# EAGLE design Main_PCB (EAGLE 9.6.1)

## Sheet 1 of 2
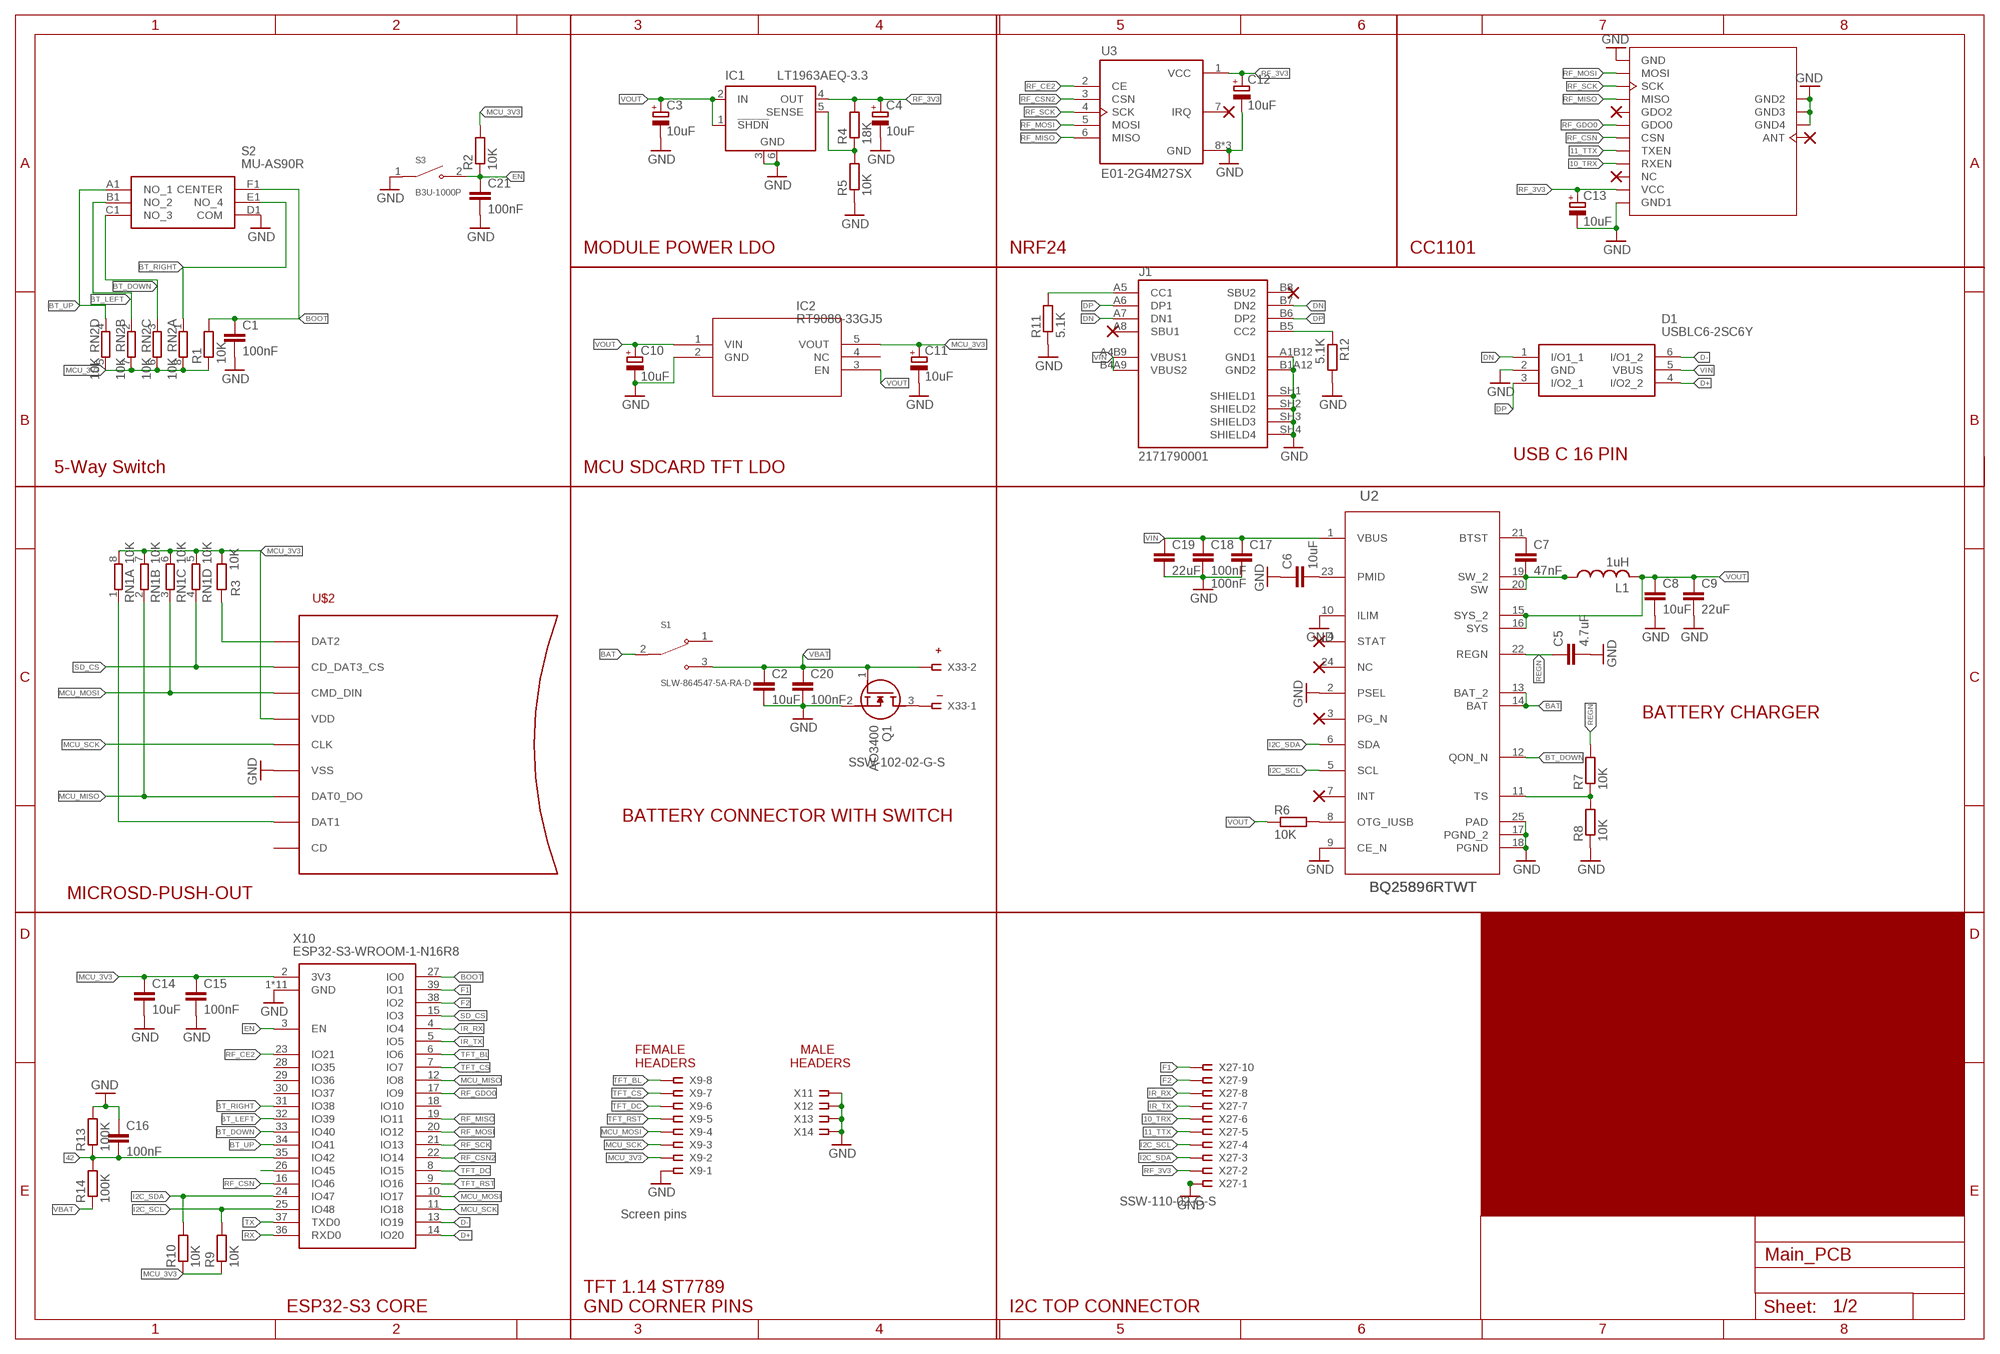
[diagram p0: schematic, sheet 1]

### Parts
C1  100nF  C-EUC0603  [C0603]
C2  10uF  C-EUC0603  [C0603]
C3  10uF  CPOL-EUCT3216  [CT3216]
C4  10uF  CPOL-EUCT3216  [CT3216]
C5  4.7uF  C-EUC0603  [C0603]
C6  10uF  C-EUC0603  [C0603]
C7  47nF  C-EUC0603  [C0603]
C8  10uF  C-EUC0603  [C0603]
C9  22uF  C-EUC0603  [C0603]
C10  10uF  CPOL-EUCT3216  [CT3216]
C11  10uF  CPOL-EUCT3216  [CT3216]
C12  10uF  CPOL-EUCT3216  [CT3216]
C13  10uF  CPOL-EUCT3216  [CT3216]
C14  10uF  C-EUC1206  [C1206]
C15  100nF  C-EUC1206  [C1206]
C16  100nF  C-EUC0603  [C0603]
C17  100nF  C-EUC0603  [C0603]
C18  100nF  C-EUC0603  [C0603]
C19  22uF  C-EUC0603  [C0603]
C20  100nF  C-EUC0603  [C0603]
C21  100nF  C-EUC0603  [C0603]
D1  USBLC6-2SC6Y  [SOT95P280X145-6N]
IC1  LT1963AEQ-3.3  [Q5-DD]
IC2  RT9080-33GJ5  [TSOT-23-5_RIT]
J1  2171790001  [MOLEX_2171790001]
L1  1uH  L-USL4035M  [L4035M]
Q1  AO3400  [SOT95P280X125-3N]
R1  10K  R-EU_R0603  [R0603]
R2  10K  R-EU_R0603  [R0603]
R3  10K  R-EU_R0603  [R0603]
R4  18K  R-EU_R0603  [R0603]
R5  10K  R-EU_R0603  [R0603]
R6  10K  R-EU_R0603  [R0603]
R7  10K  R-EU_R0603  [R0603]
R8  10K  R-EU_R0603  [R0603]
R9  10K  R-EU_R0603  [R0603]
R10  10K  R-EU_R0603  [R0603]
R11  5.1K  R-EU_R0603  [R0603]
R12  5.1K  R-EU_R0603  [R0603]
R13  100K  R-EU_R0603  [R0603]
R14  100K  R-EU_R0603  [R0603]
RN1  10K  4R-N0603-ARV  [0603-ARV]
RN2  10K  4R-N0603-ARV  [0603-ARV]
S1  SLW-864547-5A-RA-D  [SW_SLW-864547-5A-RA-D]
S2  MU-AS90R  [MUAS90R]
S3  B3U-1000P  [SW_B3U-1000P]
U2  BQ25896RTWT  [RTW0024H]
U3  E01-2G4M27SX  [XCVR_E01-2G4M27SX]
U4  PE07-433M20S  [PE07-433M20S]
U$2  MICROSD-PUSH-OUT  [MICROSD-PUSH-OUT]
X9  Screen pins  SSW-108-02-G-S  [SSW-108-02-G-S]
X10  ESP32-S3-WROOM-1-N16R8  [ESP32S3WROOM1N8R2]
X11  SSW-101-02-G-S  [SSW-101-02-G-S]
X12  SSW-101-02-G-S  [SSW-101-02-G-S]
X13  SSW-101-02-G-S  [SSW-101-02-G-S]
X14  SSW-101-02-G-S  [SSW-101-02-G-S]
X27  SSW-110-02-G-S  [SSW-110-02-G-S]
X33  SSW-102-02-G-S  [SSW-102-02-G-S]

### Nets
10_TRX: U4.RXEN X27.6
11_TTX: U4.TXEN X27.5
42: C16.2 R13.1 R14.2 X10.35(IO42)
BAT: S1.2 U2.13(BAT_2) U2.14(BAT)
BOOT: C1.1 R1.2 S2.F1(CENTER) X10.27(IO0)
BT_DOWN: RN2.3 S2.C1(NO_3) U2.12(QON_N) X10.33(IO40)
BT_LEFT: RN2.2 S2.B1(NO_2) X10.32(IO39)
BT_RIGHT: RN2.1 S2.E1(NO_4) X10.31(IO38)
BT_UP: RN2.4 S2.A1(NO_1) X10.34(IO41)
D+: D1.4(I/O2_2) X10.14(IO20)
D-: D1.6(I/O1_2) X10.13(IO19)
DN: D1.1(I/O1_1) J1.A7(DN1) J1.B7(DN2)
DP: D1.3(I/O2_1) J1.A6(DP1) J1.B6(DP2)
EN: C21.1 R2.1 S3.2 X10.3(EN)
F1: X10.39(IO1) X27.10
F2: X10.38(IO2) X27.9
GND: C1.2 C2.2 C3.- C4.- C5.2 C6.1 C8.2 C9.2 C10.- C11.- C12.- C13.- C14.2 C15.2 C16.1 C17.2 C18.2 C19.2 C20.2 C21.2 D1.2(GND) IC1.3(GND) IC1.6(GND) IC2.2(GND) J1.A1B12(GND1) J1.B1A12(GND2) J1.SH1(SHIELD1) J1.SH2(SHIELD2) J1.SH3(SHIELD3) J1.SH4(SHIELD4) Q1.2(S) R5.1 R8.1 R11.1 R12.2 R13.2 S2.D1(COM) S3.1 U2.2(PSEL) U2.9(CE_N) U2.10(ILIM) U2.17(PGND_2) U2.18(PGND) U2.25(PAD) U3.8(GND) U3.9(GND) U3.10(GND) U4.GND U4.GND1 U4.GND2 U4.GND3 U4.GND4 U$2.6(VSS) U$2.G1(VSS) U$2.G2(VSS) U$2.G3(VSS) U$2.G4(VSS) X9.1 X10.1(GND) X10.40(GND) X10.41(GND) X10.42(GND) X10.43(GND) X10.44(GND) X10.45(GND) X10.46(GND) X10.47(GND) X10.48(GND) X10.49(GND) X11.1 X12.1 X13.1 X14.1 X27.1 ; also sheet 2
I2C_SCL: R9.2 U2.5(SCL) X10.25(IO48) X27.4
I2C_SDA: R10.2 U2.6(SDA) X10.24(IO47) X27.3
IR_RX: X10.4(IO4) X27.8
IR_TX: X10.5(IO5) X27.7
MCU_3V3: C11.+ C14.1 C15.1 IC2.5(VOUT) R1.1 R2.2 R3.2 R9.1 R10.1 RN1.5 RN1.6 RN1.7 RN1.8 RN2.5 RN2.6 RN2.7 RN2.8 U$2.4(VDD) X9.2 X10.2(3V3)
MCU_MISO: RN1.2 U$2.7(DAT0_DO) X10.12(IO8)
MCU_MOSI: RN1.3 U$2.3(CMD_DIN) X9.4 X10.10(IO17)
MCU_SCK: U$2.5(CLK) X9.3 X10.11(IO18)
N$1: J1.A5(CC1) R11.2
N$2: J1.B5(CC2) R12.1
N$4: X10.26(IO45)
N$8: R3.1 U$2.1(DAT2)
N$13: Q1.3(D) X33.1
N$16: RN1.1 U$2.8(DAT1)
N$18: IC1.5(SENSE) R4.1 R5.2
N$20: C7.1 U2.21(BTST)
N$22: C7.2 L1.1 U2.19(SW_2) U2.20(SW)
N$23: R6.2 U2.8(OTG_IUSB)
N$24: R7.1 R8.2 U2.11(TS)
N$29: C6.2 U2.23(PMID)
REGN: C5.1 R7.2 U2.22(REGN)
RF_3V3: C4.+ C12.+ C13.+ IC1.4(OUT) R4.2 U3.1(VCC) U4.VCC X27.2
RF_CE2: U3.2(CE) X10.23(IO21)
RF_CSN: U4.CSN X10.16(IO46)
RF_CSN2: U3.3(CSN) X10.22(IO14)
RF_GDO0: U4.GDO0 X10.17(IO9)
RF_MISO: U3.6(MISO) U4.MISO X10.19(IO11)
RF_MOSI: U3.5(MOSI) U4.MOSI X10.20(IO12)
RF_SCK: U3.4(SCK) U4.SCK X10.21(IO13)
RX: X10.36(RXD0)
SD_CS: RN1.4 U$2.2(CD_DAT3_CS) X10.15(IO3)
TFT_BL: X9.8 X10.6(IO6)
TFT_CS: X9.7 X10.7(IO7)
TFT_DC: X9.6 X10.8(IO15)
TFT_RST: X9.5 X10.9(IO16)
TX: X10.37(TXD0)
VBAT: C2.1 C20.1 Q1.1(G) R14.1 S1.3 X33.2
VIN: C17.1 C18.1 C19.1 D1.5(VBUS) J1.A4B9(VBUS1) J1.B4A9(VBUS2) U2.1(VBUS)
VOUT: C3.+ C8.1 C9.1 C10.+ IC1.1(!SHDN) IC1.2(IN) IC2.1(VIN) IC2.3(EN) L1.2 R6.1 U2.15(SYS_2) U2.16(SYS)
Unconnected: IC2.4(NC) J1.A8(SBU1) J1.B8(SBU2) S1.1 U2.3(PG_N) U2.4(STAT) U2.7(INT) U2.24(NC) U3.7(IRQ) U4.ANT U4.GDO2 U4.NC U$2.CD X10.18(IO10) X10.28(IO35) X10.29(IO36) X10.30(IO37)

### Notes on the sheet
- MODULE POWER LDO | NRF24 | CC1101
- USB C 16 PIN
- 5-Way Switch | MCU SDCARD TFT LDO
- BATTERY CHARGER
- BATTERY CONNECTOR WITH SWITCH
- FEMALE 
  HEADERS
- MALE 
  HEADERS
- ESP32-S3 CORE
- TFT 1.14 ST7789
  GND CORNER PINS
- I2C TOP CONNECTOR

## Sheet 2 of 2
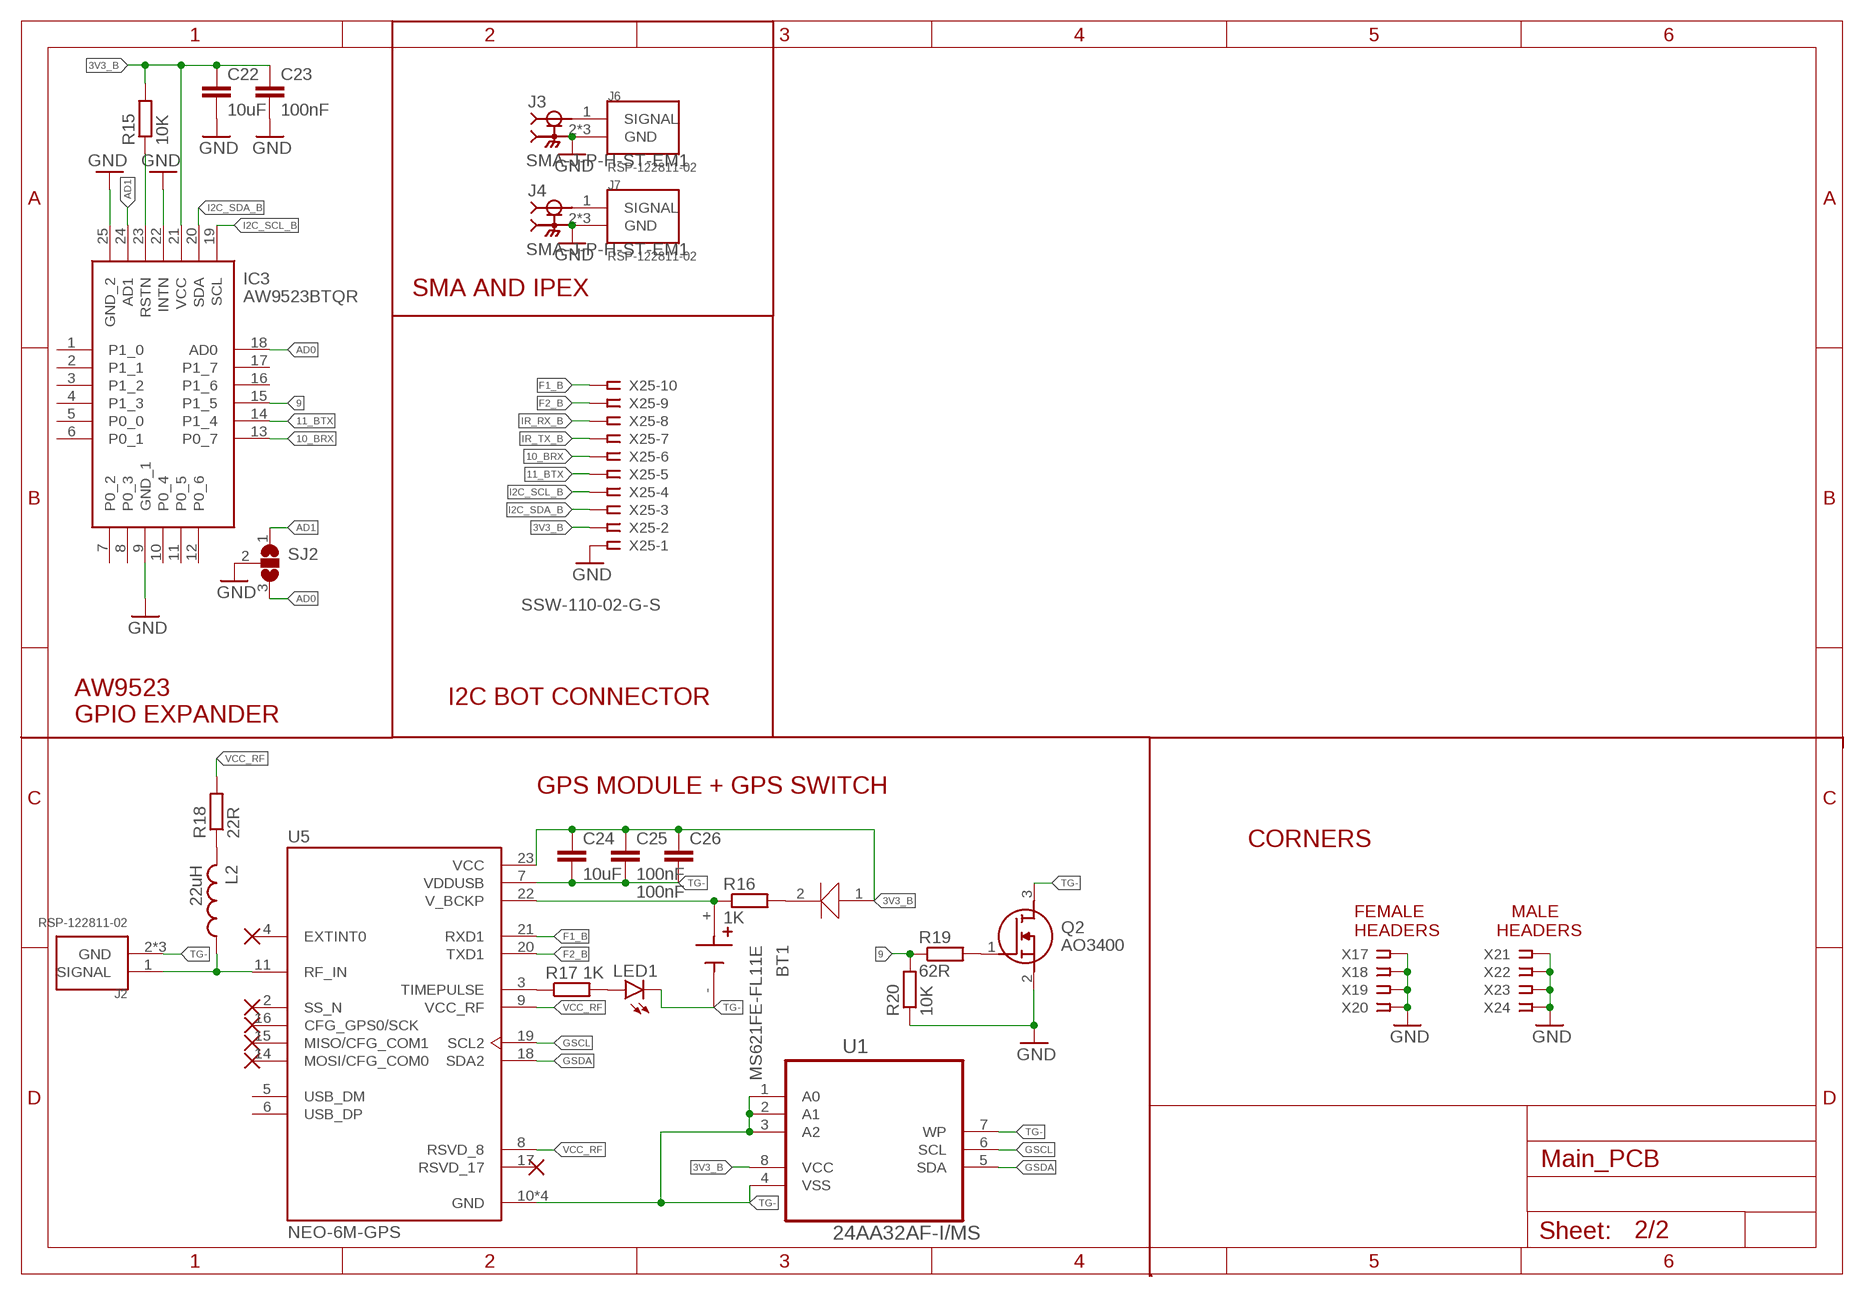
[diagram p1: schematic, sheet 2]

### Parts
BT1  MS621FE-FL11E  [BAT_MS621FE-FL11E]
C22  10uF  C-EUC0603  [C0603]
C23  100nF  C-EUC0603  [C0603]
C24  10uF  C-EUC0603  [C0603]
C25  100nF  C-EUC0603  [C0603]
C26  100nF  C-EUC0603  [C0603]
IC3  AW9523BTQR  [QFN50P400X400X80-25N]
J2  RSP-122811-02  [SAMTEC_RSP-122811-02]
J3  SMA-J-P-H-ST-EM1  [SAMTEC_SMA-J-P-H-ST-EM1]
J4  SMA-J-P-H-ST-EM1  [SAMTEC_SMA-J-P-H-ST-EM1]
J6  RSP-122811-02  [SAMTEC_RSP-122811-02]
J7  RSP-122811-02  [SAMTEC_RSP-122811-02]
L2  22uH  L-USL3225P  [L3225P]
LED1  LEDCHIP-LED0805  [CHIP-LED0805]
Q2  AO3400  [SOT95P280X125-3N]
R15  10K  R-EU_R0603  [R0603]
R16  1K  R-EU_R0603  [R0603]
R17  1K  R-EU_R0603  [R0603]
R18  22R  R-EU_R0603  [R0603]
R19  62R  R-EU_R0603  [R0603]
R20  10K  R-EU_R0603  [R0603]
SJ2  SJ2W  [SJ_2]
U1  24AA32AF-I/MS  [SOP65P490X110-8N]
U5  NEO-6M-GPS  [XCVR_NEO-6M-GPS]
U$1  5817SMJ_TR13  [DIOM5336X250N]
X17  SSW-101-02-G-S  [SSW-101-02-G-S]
X18  SSW-101-02-G-S  [SSW-101-02-G-S]
X19  SSW-101-02-G-S  [SSW-101-02-G-S]
X20  SSW-101-02-G-S  [SSW-101-02-G-S]
X21  SSW-101-02-G-S  [SSW-101-02-G-S]
X22  SSW-101-02-G-S  [SSW-101-02-G-S]
X23  SSW-101-02-G-S  [SSW-101-02-G-S]
X24  SSW-101-02-G-S  [SSW-101-02-G-S]
X25  SSW-110-02-G-S  [SSW-110-02-G-S]

### Nets
3V3_B: C22.1 C23.1 C24.1 C25.1 C26.1 IC3.21(VCC) R15.2 U1.8(VCC) U5.23(VCC) U$1.1 X25.2
9: IC3.15(P1_5) R19.1 R20.2
10_BRX: IC3.13(P0_7) X25.6
11_BTX: IC3.14(P1_4) X25.5
AD0: IC3.18(AD0) SJ2.3
AD1: IC3.24(AD1) SJ2.1
F1_B: U5.21(RXD1) X25.10
F2_B: U5.20(TXD1) X25.9
GND: C22.2 C23.2 IC3.9(GND_1) IC3.22(INTN) IC3.25(GND_2) J3.2_1 J3.2_2 J3.3_1 J3.3_2 J4.2_1 J4.2_2 J4.3_1 J4.3_2 J6.2(GND) J6.3(GND) J6.4(GND) J7.2(GND) J7.3(GND) J7.4(GND) Q2.2(S) R20.1 SJ2.2 X17.1 X18.1 X19.1 X20.1 X21.1 X22.1 X23.1 X24.1 X25.1 ; also sheet 1
GSCL: U1.6(SCL) U5.19(SCL2)
GSDA: U1.5(SDA) U5.18(SDA2)
I2C_SCL_B: IC3.19(SCL) X25.4
I2C_SDA_B: IC3.20(SDA) X25.3
IR_RX_B: X25.8
IR_TX_B: X25.7
N$3: BT1.+ R16.1 U5.22(V_BCKP)
N$5: R17.1 U5.3(TIMEPULSE)
N$6: LED1.A R17.2
N$7: R16.2 U$1.2
N$9: J2.1(SIGNAL) L2.1 U5.11(RF_IN)
N$10: IC3.23(RSTN) R15.1
N$11: L2.2 R18.1
N$12: Q2.1(G) R19.2
N$15: J3.1 J6.1(SIGNAL)
N$19: J4.1 J7.1(SIGNAL)
TG-: BT1.- C24.2 C25.2 C26.2 J2.2(GND) J2.3(GND) J2.4(GND) LED1.C Q2.3(D) U1.1(A0) U1.2(A1) U1.3(A2) U1.4(VSS) U1.7(WP) U5.7(VDDUSB) U5.10(GND) U5.12(GND) U5.13(GND) U5.24(GND)
VCC_RF: R18.2 U5.8(RSVD_8) U5.9(VCC_RF)
Unconnected: IC3.1(P1_0) IC3.2(P1_1) IC3.3(P1_2) IC3.4(P1_3) IC3.5(P0_0) IC3.6(P0_1) IC3.7(P0_2) IC3.8(P0_3) IC3.10(P0_4) IC3.11(P0_5) IC3.12(P0_6) IC3.16(P1_6) IC3.17(P1_7) U5.2(SS_N) U5.4(EXTINT0) U5.5(USB_DM) U5.6(USB_DP) U5.14(MOSI/CFG_COM0) U5.15(MISO/CFG_COM1) U5.16(CFG_GPS0/SCK) U5.17(RSVD_17)

### Notes on the sheet
- SMA AND IPEX
- I2C BOT CONNECTOR
- AW9523
  GPIO EXPANDER
- GPS MODULE + GPS SWITCH
- CORNERS
- FEMALE
  HEADERS
- MALE
  HEADERS

## Library data of the parts
BT1 = MS621FE-FL11E:MS621FE-FL11E: Check availability <https://pricing.snapeda.com/parts/MS621FE-FL11E/Seiko%20Instruments/view-part?ref=eda>; AVAILABILITY: In Stock; CHECK_PRICES: https://www.snapeda.com/parts/MS621FE-FL11E/Seiko/view-part/?ref=eda; DESCRIPTION: Coin, 6.8mm 3 V Lithium Battery Rechargeable (Secondary) 5.5mAh; MF: Seiko Instruments; MP: MS621FE-FL11E; PACKAGE: QFP-128 Seiko; PRICE: None; SNAPEDA_LINK: https://www.snapeda.com/parts/MS621FE-FL11E/Seiko/view-part/?ref=snap
C1 C2 C5-C9 C14-C26 = rcl:C-EU: CAPACITOR, European symbol; SPICEPREFIX: C
C3 C4 C10-C13 = rcl:CPOL-EU: POLARIZED CAPACITOR, European symbol; SPICEPREFIX: C
D1 = USBLC6-2SC6Y:USBLC6-2SC6Y: Check availability <https://pricing.snapeda.com/parts/USBLC6-2SC6Y/STMicroelectronics/view-part?ref=eda>; AVAILABILITY: In Stock; CHECK_PRICES: https://www.snapeda.com/parts/USBLC6-2SC6Y/STMicroelectronics/view-part/?ref=eda; DESCRIPTION: 17V Clamp 5A (8/20µs) Ipp Tvs Diode Surface Mount SOT-23-6; MF: STMicroelectronics; MP: USBLC6-2SC6Y; PACKAGE: SOT-23-6 STMicroelectronics; PRICE: None; SNAPEDA_LINK: https://www.snapeda.com/parts/USBLC6-2SC6Y/STMicroelectronics/view-part/?ref=snap
IC1 = linear-technology:LT1963AEQ*: LT1963 1.5A, Low Noise, Fast Transient Response LDO Regulator Source: http://www.linear.com; MPN: LT1963AEQ-3.3; OC_FARNELL: 1273626; OC_NEWARK: 57M7439
IC2 = RT9080-33GJ5:RT9080-33GJ5; COPYRIGHT: Copyright (C) 2025 Ultra Librarian. All rights reserved.; MANUFACTURER_PART_NUMBER: RT9080-33GJ5; MFR_NAME: Richtek Technology
IC3 = AW9523BTQR:AW9523BTQR: 16 MULTI-FUNCTION LED DRIVER AND GPIO CONTROLLER WITH I2C INTERFACE Source: Datasheet <https://www.alldatasheet.net/datasheet-pdf/pdf/1148543/AWINIC/AW9523BTQR.html>; DESCRIPTION: 16 MULTI-FUNCTION LED DRIVER AND GPIO CONTROLLER WITH I2C INTERFACE; HEIGHT: 0.8mm; MANUFACTURER_NAME: AWINIC; MANUFACTURER_PART_NUMBER: AW9523BTQR
J1 = type_C:2171790001: Check availability <https://pricing.snapeda.com/parts/217179-0001/Molex/view-part?ref=eda>; AVAILABILITY: In Stock; CHECK_PRICES: https://www.snapeda.com/parts/217179-0001/Molex/view-part/?ref=eda; DESCRIPTION: USB Type C - Connector, Top-mount SMT, 16pos | Molex Incorporated 217179-0001; MF: Molex; MP: 217179-0001; PACKAGE: None; PRICE: None; SNAPEDA_LINK: https://www.snapeda.com/parts/217179-0001/Molex/view-part/?ref=snap
J2 J6 J7 = IPEX_conn_male:RSP-122811-02: Check availability <https://pricing.snapeda.com/parts/RSP-122811-02/Samtec%20Inc./view-part?ref=eda>; AVAILABILITY: In Stock; CHECK_PRICES: https://www.snapeda.com/parts/RSP-122811-02/Samtec+Inc./view-part/?ref=eda; DESCRIPTION: I-PEX MHFIII Connector Receptacle, Male Pin 50 Ohms Surface Mount Solder; MF: Samtec Inc.; MP: RSP-122811-02; PACKAGE: None; PRICE: None; SNAPEDA_LINK: https://www.snapeda.com/parts/RSP-122811-02/Samtec+Inc./view-part/?ref=snap
J3 J4 = SMA-J-P-H-ST-EM1:SMA-J-P-H-ST-EM1: Check availability <https://pricing.snapeda.com/parts/SMA-J-P-H-ST-EM1/Samtec/view-part?ref=eda>; AVAILABILITY: In Stock; CHECK_PRICES: https://www.snapeda.com/parts/SMA-J-P-H-ST-EM1/Samtec+Inc./view-part/?ref=eda; DESCRIPTION: SMA Connector Jack, Female Socket 50 Ohms Board Edge, End Launch Solder; MF: Samtec; MP: SMA-J-P-H-ST-EM1; PACKAGE: None; PRICE: None; SNAPEDA_LINK: https://www.snapeda.com/parts/SMA-J-P-H-ST-EM1/Samtec+Inc./view-part/?ref=snap
L1 L2 = rcl:L-US: INDUCTOR, American symbol; SPICEPREFIX: L
LED1 = led:LED: LED OSRAM: - CHIPLED LG R971, LG N971, LY N971, LG Q971, LY Q971, LO R971, LY R971 LH N974, LH R974 LS Q976, LO Q976, LY Q976 LO Q996 - Hyper CHIPLED LW Q18S LB Q993, LB Q99A, LB R99A - SideLED LS A670, LO A670, LY A670, LG A670, LP A670 LB A673, LV A673, LT A673, LW A673 LH A674 LY A675 LS A676, LA A676, LO A676, LY A676, LW A676 LS A679, LY A679, LG A679 - Hyper Micro SIDELED® LS Y876, LA Y876, LO Y876, LY Y876 LT Y87S - SmartLED LW L88C, LW L88S LB L89C, LB L89S, LG L890 LS L89K, LO L89K, LY L89K LS L896, LA L896, LO L896, LY L896 - TOPLED LS T670, LO T670, LY T670, LG T670, LP T670 LSG T670, LSP T670, LSY T670, LOP T670, LYG T670 LG T671, LOG T671, LSG T671 LB T673, LV T673, LT T673, LW T673 LH T674 LS T676, LA T676, LO T676, LY T676, LB T676, LH T676, LSB T676, LW T676 LB T67C, LV T67C, LT T67C, LS T67K, LO T67K, LY T67K, LW E67C LS E67B, LA E67B, LO E67B, LY E67B, LB E67C, LV E67C, LT E67C LW T67C LS T679, LY T679, LG T679 LS T770, LO T770, LY T770, LG T770, LP T770 LB T773, LV T773, LT T773, LW T773 LH T774 LS E675, LA E675, LY E675, LS T675 LS T776, LA T776, LO T776, LY T776, LB T776 LHGB T686 LT T68C, LB T68C - Hyper Mini TOPLED® LB M676 - Mini TOPLED Santana® LG M470 LS M47K, LO M47K, LY M47K Source: http://www.osram.convergy.de LUXEON: - LUMILED® LXK2-PW12-R00, LXK2-PW12-S00, LXK2-PW14-U00, LXK2-PW14-V00 LXK2-PM12-R00, LXK2-PM12-S00, LXK2-PM14-U00 LXK2-PE12-Q00, LXK2-PE12-R00, LXK2-PE12-S00, LXK2-PE14-T00, LXK2-PE14-U00 LXK2-PB12-K00, LXK2-PB12-L00, LXK2-PB12-M00, LXK2-PB14-N00, LXK2-PB14-P00, LXK2-PB14-Q00 LXK2-PR12-L00, LXK2-PR12-M00, LXK2-PR14-Q00, LXK2-PR14-R00 LXK2-PD12-Q00, LXK2-PD12-R00, LXK2-PD12-S00 LXK2-PH12-R00, LXK2-PH12-S00 LXK2-PL12-P00, LXK2-PL12-Q00, LXK2-PL12-R00 Source: www.luxeon.com KINGBRIGHT: KA-3528ASYC Source: www.kingbright.com
Q1 Q2 = AO3400:AO3400: Check availability <https://pricing.snapeda.com/parts/AO3400/Alpha%20%26/view-part?ref=eda>; AVAILABILITY: In Stock; CHECK_PRICES: https://www.snapeda.com/parts/AO3400/Alpha/view-part/?ref=eda; DESCRIPTION: N-Channel 30 V 5.8A (Ta) 1.4W (Ta) Surface Mount SOT-23-3; MF: Alpha &; MP: AO3400; PACKAGE: SOT-23-3 Alpha &amp; Omega Semiconductor; PRICE: None; SNAPEDA_LINK: https://www.snapeda.com/parts/AO3400/Alpha/view-part/?ref=snap
R1-R20 = rcl:R-EU_: RESISTOR, European symbol; SPICEPREFIX: R
RN1 RN2 = resistor-dil:4R-N: Array Chip Resistor Source: RS Component / Phycomp; OC_FARNELL: unknown; OC_NEWARK: unknown
S1 = 90°Switch:SLW-864547-5A-RA-D: Check availability <https://pricing.snapeda.com/parts/SLW-864547-5A-RA-D/Same%20Sky/view-part?ref=eda>; AVAILABILITY: In Stock; CHECK_PRICES: https://www.snapeda.com/parts/SLW-864547-5A-RA-D/Same+Sky/view-part/?ref=eda; DESCRIPTION: 8.6 x 4.5 x 4.7 mm, 5 mm Raised Slide Actuator, Right Angle, Through Hole, Slide Switch; MF: Same Sky; MP: SLW-864547-5A-RA-D; PACKAGE: None; PRICE: None; SNAPEDA_LINK: https://www.snapeda.com/parts/SLW-864547-5A-RA-D/Same+Sky/view-part/?ref=snap
S2 = MU-AS90R:MU-AS90R: Multi-Directional Switches 5-way Switch, SMD, Height 9mm Source: Datasheet <https://www.apem.com/idec-apem/en_US/medias/PCB-MU-serie.pdf?context=bWFzdGVyfGRvY3VtZW50c3w0MTk2OTF8YXBwbGljYXRpb24vcGRmfGg2ZC9oMGEvOTQ2NDU3NTQyNjU5MC9QQ0JfTVVfc2VyaWUucGRmfDhmZDg0OWQ5ZjViYWFlZjljODY5ZmI3YmMzY2U3MzBjNmNiMzE0MzZkY2ZmMjQ4ZGRjNTJjOWQ0ZTc0NG>; DESCRIPTION: Multi-Directional Switches 5-way Switch, SMD, Height 9mm; HEIGHT: 9.2mm; MANUFACTURER_NAME: Apem; MANUFACTURER_PART_NUMBER: MU-AS90R; MOUSER_PART_NUMBER: 642-MU-AS90R; MOUSER_PRICE-STOCK: https://www.mouser.co.uk/ProductDetail/Apem/MU-AS90R?qs=mELouGlnn3cGEpjh4y0%2F8w%3D%3D
S3 = SMD_button:B3U-1000P: Switch Tactile N.O. SPST Round Button Gull Wing 0.05A 12VDC 1.5N SMD Embossed T/R Check availability <https://pricing.snapeda.com/parts/B3U-1000P/Omron/view-part?ref=eda>; AVAILABILITY: In Stock; CHECK_PRICES: https://www.snapeda.com/parts/B3U-1000P/Omron+Electronics+Inc-EMC+Div/view-part/?ref=eda; DESCRIPTION: SWITCH;TACTILE,TOP ACTUATED,TACTILE & JOG SWITCHES W/O BOSS W/O GROUND | Omron Electronic Components B3U-1000P; MF: Omron; MP: B3U-1000P; PACKAGE: Custom Package Omron; PRICE: None; SNAPEDA_LINK: https://www.snapeda.com/parts/B3U-1000P/Omron+Electronics+Inc-EMC+Div/view-part/?ref=snap
SJ2 = jumper:SJ2W: SMD solder JUMPER
U1 = 24AA32AF-I_MS:24AA32AF-I/MS: Check availability <https://pricing.snapeda.com/parts/24AA32AF-I/MS/Microchip/view-part?ref=eda>; AVAILABILITY: In Stock; CHECK_PRICES: https://www.snapeda.com/parts/24AA32AF-I/MS/Microchip/view-part/?ref=eda; DESCRIPTION: 32K, 4K X 8 1.8V SERIAL EE IND, 1/4 ARRAY WRITE PROTECT8 MSOP 3x3mm TUBE | Microchip Technology Inc. 24AA32AF-I/MS; MF: Microchip; MP: 24AA32AF-I/MS; PACKAGE: MSOP-8 Microchip; PRICE: None; SNAPEDA_LINK: https://www.snapeda.com/parts/24AA32AF-I/MS/Microchip/view-part/?ref=snap
U2 = BQ25896RTWT:BQ25896RTWT; COPYRIGHT: Copyright (C) 2025 Ultra Librarian. All rights reserved.; MANUFACTURER_PART_NUMBER: BQ25896RTWT; MFR_NAME: Texas Instruments; REFDES: RefDes; TYPE: TYPE
U3 = E01-2G4M27SX:E01-2G4M27SX: Check availability <https://pricing.snapeda.com/parts/E01-2G4M27SX/EBYTE/view-part?ref=eda>; AVAILABILITY: Not in stock; CHECK_PRICES: https://www.snapeda.com/parts/E01-2G4M27SX/EBYTE/view-part/?ref=eda; DESCRIPTION: nRF42L01+2.4GHz 500mW SPI SMD wireless module; MF: EBYTE; MP: E01-2G4M27SX; PACKAGE: Package; PRICE: None; SNAPEDA_LINK: https://www.snapeda.com/parts/E01-2G4M27SX/EBYTE/view-part/?ref=snap
U4 = E07-CC1101:PE07-433M20S
U5 = NEO-6M-GPS:NEO-6M-GPS: Check availability <https://pricing.snapeda.com/parts/NEO-6M-GPS/u-blox/view-part?ref=eda>; AVAILABILITY: Not in stock; CHECK_PRICES: https://www.snapeda.com/parts/NEO-6M-GPS/u-blox/view-part/?ref=eda; DESCRIPTION: GPS Development Tools SparkFun GNSS-RTK Dead Reckoning Breakout - ZED-F9K (Qwiic); MF: u-blox; MP: NEO-6M-GPS; PACKAGE: None; PRICE: None; SNAPEDA_LINK: https://www.snapeda.com/parts/NEO-6M-GPS/u-blox/view-part/?ref=snap
U$1 = 5817SMJ_TR13:5817SMJ_TR13
U$2 = microsd:MICROSD-PUSH-OUT: T-Flash Push-Out Micro SD Card Reader 14.75mm x 14.5mm SMD with external pins
X9 = con-samtec:SSW-108-02-G-S: THROUGH-HOLE .025" SQ POST SOCKET Source: Samtec SSW.pdf; MF: Samtec Inc.; MPN: SSW-108-02-G-S; OC_FARNELL: unknown; OC_NEWARK: 11P9448
X10 = ESP32-S3-WROOM-1-N16R8:ESP32-S3-WROOM-1-N16R8: Check availability <https://pricing.snapeda.com/parts/ESP32-S3-WROOM-1-N16R8/Espressif%20Systems/view-part?ref=eda>; AVAILABILITY: In Stock; CHECK_PRICES: https://www.snapeda.com/parts/ESP32-S3-WROOM-1-N16R8/Espressif+Systems/view-part/?ref=eda; DESCRIPTION: Bluetooth, WiFi 802.11b/g/n, Bluetooth v5.0 Transceiver Module 2.4GHz PCB Trace Surface Mount; MF: Espressif Systems; MP: ESP32-S3-WROOM-1-N16R8; PACKAGE: NON STANDARD Espressif Systems; PRICE: None; SNAPEDA_LINK: https://www.snapeda.com/parts/ESP32-S3-WROOM-1-N16R8/Espressif+Systems/view-part/?ref=snap
X11-X14 X17-X24 = con-samtec:SSW-101-02-G-S: THROUGH-HOLE .025" SQ POST SOCKET Source: Samtec SSW.pdf; MF: Samtec Inc.; MPN: SSW-101-02-G-S; OC_FARNELL: unknown; OC_NEWARK: 11P9336
X25 X27 = con-samtec:SSW-110-02-G-S: THROUGH-HOLE .025" SQ POST SOCKET Source: Samtec SSW.pdf; MF: Samtec Inc.; MPN: SSW-110-02-G-S; OC_FARNELL: unknown; OC_NEWARK: 11P9482
X33 = con-samtec:SSW-102-02-G-S: THROUGH-HOLE .025" SQ POST SOCKET Source: Samtec SSW.pdf; MF: Samtec Inc.; MPN: SSW-102-02-G-S; OC_FARNELL: unknown; OC_NEWARK: 11P9351

## Board
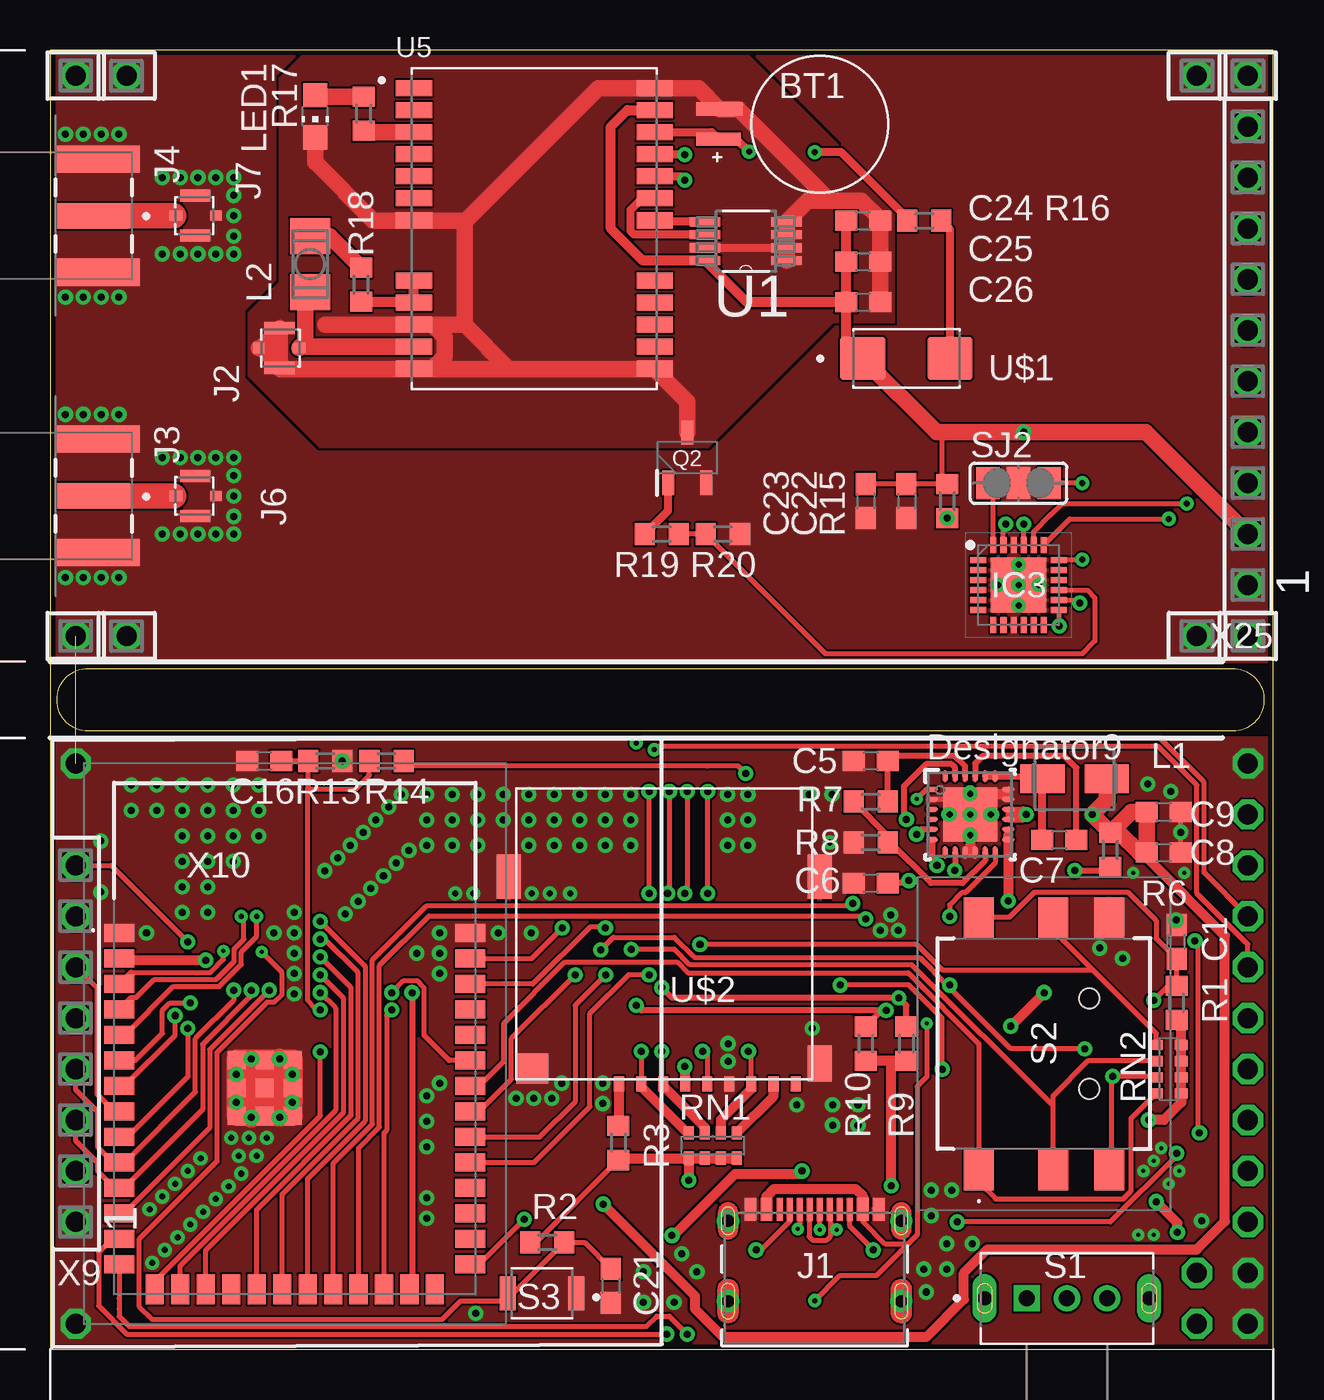
[diagram p2: board, top side]
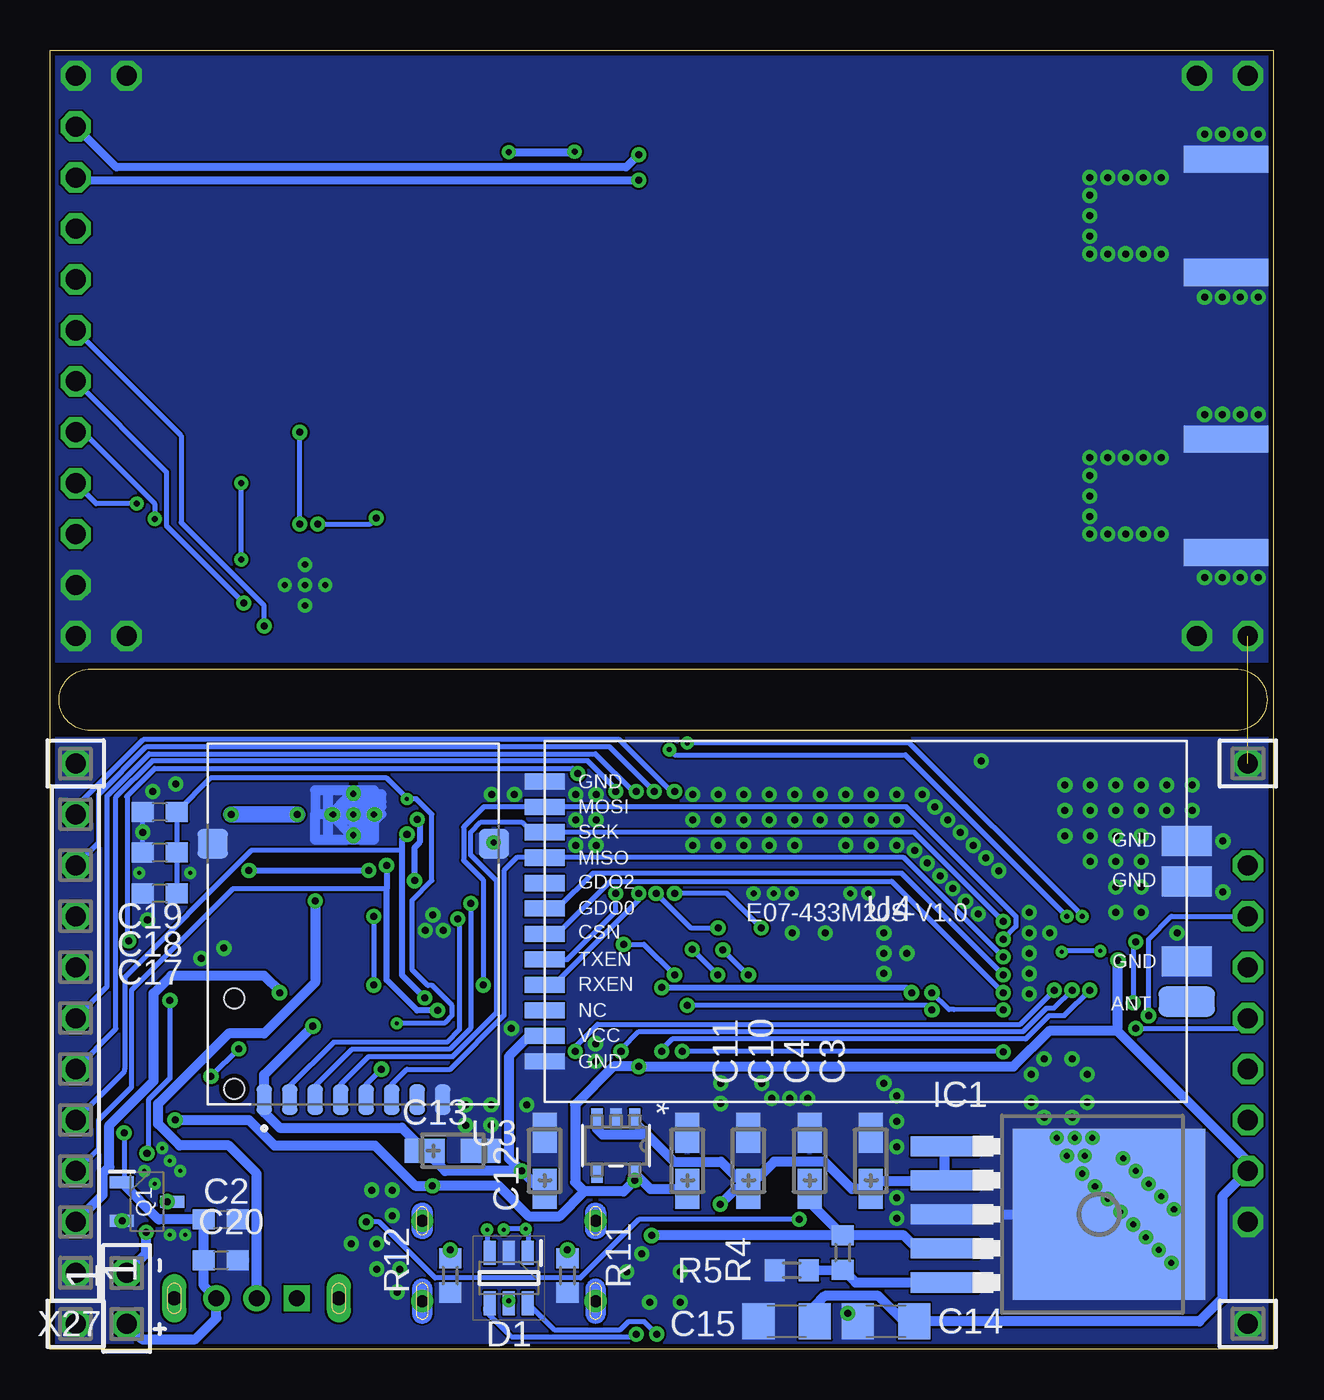
[diagram p3: board, bottom side, seen from below]

Size 60.96 x 64.77 mm. Coordinates in mm from the lower left corner, seen from the top.
Outline: 1.78,30.86 1.91,30.86
Outline: 1.91,30.86 58.93,30.86 arc180 59.05,33.91 1.91,33.91 arc185 1.91,30.86
Outline: 0,0 60.96,0 60.96,64.77 0,64.77 0,0
Copper layers (1*16): Top 0.035mm / dielectric 1.5mm / Bottom 0.035mm
Design rules "default *": minimum track width 4mil, minimum drill 0.1mm, track to track 4mil, track to pad 4mil, pad to pad 4mil, via to via 4mil, smd to smd 4mil, copper to edge 10mil, drill to drill 4mil, minimum pad ring 10mil, minimum via ring 8mil, stop-mask expansion 4mil, vias tented up to drill 0mil, thermal gap 0mil

### Footprints (pad centres in the part's own frame; a part is rotated, then mirrored left to right if it is on the bottom)
BAT_MS621FE-FL11E = smd 2.2 x 0.65: + 5.05,0.75 | smd 2.3 x 0.65: - 5,-0.75
C0603 = smd 1.1 x 1: 1 -0.85,0; 2 0.85,0
CT3216 = smd 2 x 1.2: + -1.4,0; - 1.4,0
C1206 = smd 1.6 x 1.8: 1 -1.4,0; 2 1.4,0
SOT95P280X145-6N = smd 1.2 x 0.6: 1 -1.25,0.95; 2 -1.25,0; 3 -1.25,-0.95; 4 1.25,-0.95; 5 1.25,0; 6 1.25,0.95
Q5-DD = smd 1 x 3.4: 1 -3.4,-7.875; 2 -1.7,-7.875; 3 0,-7.875; 4 1.7,-7.875; 5 3.4,-7.875 | smd 8.5 x 9.6: 6 0,0.325
TSOT-23-5_RIT = smd 0.953 x 0.559: 1 -1.378,0.94; 2 -1.378,0; 3 -1.378,-0.94; 4 1.378,-0.94; 5 1.378,0.94
QFN50P400X400X80-25N = smd 0.8 x 0.3: 1 -2,1.25; 2 -2,0.75; 3 -2,0.25; 4 -2,-0.25; 5 -2,-0.75; 6 -2,-1.25; 13 2,-1.25; 14 2,-0.75; 15 2,-0.25; 16 2,0.25; 17 2,0.75; 18 2,1.25 | smd 0.3 x 0.8: 7 -1.25,-2; 8 -0.75,-2; 9 -0.25,-2; 10 0.25,-2; 11 0.75,-2; 12 1.25,-2; 19 1.25,2; 20 0.75,2; 21 0.25,2; 22 -0.25,2; 23 -0.75,2; 24 -1.25,2 | smd 2.75 x 2.75: 25 0,0
MOLEX_2171790001 = smd 0.59 x 1.15: A1B12 -3.2,3.425; A4B9 -2.4,3.425; B1A12 3.2,3.425; B4A9 2.4,3.425 | smd 0.298 x 1.15: A5 -1.25,3.425; A6 -0.25,3.425; A7 0.25,3.425; A8 1.25,3.425; B5 1.75,3.425; B6 0.75,3.425; B7 -0.75,3.425; B8 -1.75,3.425 | drill 0.6 pad 1: SH1 -4.32,-1.15; SH2 4.32,-1.15; SH3 -4.32,2.85; SH4 4.32,2.85
SAMTEC_RSP-122811-02 = smd 0.5 x 0.65: 1 0,-0.975 | smd 0.6 x 1.5: 2 -1,0; 4 1,0 | smd 0.5 x 0.55: 3 0,1.025
SAMTEC_SMA-J-P-H-ST-EM1 = smd 1.27 x 3.6: 1 0,0 | smd 1.35 x 4.2: 2_1 -2.825,0.2; 3_1 2.825,0.2 | smd 1.35 x 4.2 bottom: 2_2 -2.825,0.2; 3_2 2.825,0.2
L4035M = smd 2.2 x 1.4: 1 -1.6,0; 2 1.6,0
L3225P = smd 1.8 x 2: 1 -1.4,0; 2 1.4,0
CHIP-LED0805 = smd 1.2 x 1.2: A 0,-1.05; C 0,1.05
SOT95P280X125-3N = smd 1.2 x 0.6: 1 -1.25,0.95; 2 -1.25,-0.95; 3 1.25,0
R0603 = smd 1 x 1.1: 1 -0.85,0; 2 0.85,0
0603-ARV = smd 0.5 x 0.65: 1 -1.2,-0.625; 2 -0.4,-0.625; 3 0.4,-0.625; 4 1.2,-0.625; 5 1.2,0.625; 6 0.4,0.625; 7 -0.4,0.625; 8 -1.2,0.625
SW_SLW-864547-5A-RA-D = drill 0.8 square: 1 -2,0 | drill 0.8: 2 0,0; 3 2,0 | drill 0.7 pad 1.1 long: SH1 -4.1,0; SH2 4.1,0
MUAS90R = smd 2 x 1.5: A1 -6.3,3.25; B1 -6.3,-0.45; C1 -6.3,-3.25; D1 6.3,-3.25; E1 6.3,-0.45; F1 6.3,3.25 | hole 1: -2.25,-2.25; 2.25,-2.25
SW_B3U-1000P = smd 0.8 x 1.7: 1 -1.7,0; 2 1.7,0
SJ_2 = smd 1.168 x 1.6: 1 -1.524,0; 2 0,0; 3 1.524,0
SOP65P490X110-8N = smd 1.524 x 0.457: 1 -2.032,0.965; 2 -2.032,0.33; 3 -2.032,-0.33; 4 -2.032,-0.965; 5 2.032,-0.965; 6 2.032,-0.33; 7 2.032,0.33; 8 2.032,0.965
RTW0024H = smd 0.6 x 0.24: 1 -1.9,1.25; 2 -1.9,0.75; 3 -1.9,0.25; 4 -1.9,-0.25; 5 -1.9,-0.75; 6 -1.9,-1.25; 13 1.9,-1.25; 14 1.9,-0.75; 15 1.9,-0.25; 16 1.9,0.25; 17 1.9,0.75; 18 1.9,1.25 | smd 0.24 x 0.6: 7 -1.25,-1.9; 8 -0.75,-1.9; 9 -0.25,-1.9; 10 0.25,-1.9; 11 0.75,-1.9; 12 1.25,-1.9; 19 1.25,1.9; 20 0.75,1.9; 21 0.25,1.9; 22 -0.25,1.9; 23 -0.75,1.9; 24 -1.25,1.9 | smd 2.7 x 2.7: 25 0,0 | drill 0.203 pad 0.508: V 0,-1.092; V_1 1.092,0; V_2 0,0; V_3 -1.092,0; V_4 0,1.092
XCVR_E01-2G4M27SX = smd 0.77 x 1.51: 1 4.445,8.76; 2 3.175,8.76; 3 1.905,8.76; 4 0.635,8.76; 5 -0.635,8.76; 6 -1.905,8.76; 7 -3.175,8.76; 8 -4.445,8.76 | smd 1.51 x 1.47: 9 -7.01,-4; 10 7.01,-4
PE07-433M20S = smd 2.8 x 1.5: ANT 16,-4 | smd 2 x 0.8: CSN -16,-0.635; GDO0 -16,0.635; GDO2 -16,1.905; GND -16,6.985; GND1 -16,-6.985; MISO -16,3.175; MOSI -16,5.715; NC -16,-4.445; RXEN -16,-3.175; SCK -16,4.445; TXEN -16,-1.905; VCC -16,-5.715 | smd 2.5 x 1.5: GND2 16,4; GND3 16,2; GND4 16,-2
XCVR_NEO-6M-GPS = smd 1.8 x 0.8: 1 -6,7; 2 -6,5.9; 3 -6,4.8; 4 -6,3.7; 5 -6,2.6; 6 -6,1.5; 7 -6,0.4; 8 -6,-2.6; 9 -6,-3.7; 10 -6,-4.8; 11 -6,-5.9; 12 -6,-7; 13 6,-7; 14 6,-5.9; 15 6,-4.8; 16 6,-3.7; 17 6,-2.6; 18 6,0.4; 19 6,1.5; 20 6,2.6; 21 6,3.7; 22 6,4.8; 23 6,5.9; 24 6,7
DIOM5336X250N = smd 2.25 x 2.13: 1 -2.175,0; 2 2.175,0
MICROSD-PUSH-OUT = smd 0.5 x 0.75: 1 9.625,0.225; 2 8.525,0.225; 3 7.425,0.225; 4 6.325,0.225; 5 5.225,0.225; 6 4.125,0.225; 7 3.025,0.225; 8 1.925,0.225; CD 0.825,0.225 | smd 1.2 x 1.8: G1 -0.375,-0.8 | smd 1.2 x 2.2: G2 -0.375,-10.1; G4 15.125,-10.1 | smd 1.6 x 1.5: G3 13.95,-0.55
SSW-108-02-G-S = drill 1 pad 1.5 octagon: 1 -8.89,0; 2 -6.35,0; 3 -3.81,0; 4 -1.27,0; 5 1.27,0; 6 3.81,0; 7 6.35,0; 8 8.89,0
ESP32S3WROOM1N8R2 = smd 1.5 x 0.9: 1 -8.75,5.26; 2 -8.75,3.99; 3 -8.75,2.72; 4 -8.75,1.45; 5 -8.75,0.18; 6 -8.75,-1.09; 7 -8.75,-2.36; 8 -8.75,-3.63; 9 -8.75,-4.9; 10 -8.75,-6.17; 11 -8.75,-7.44; 12 -8.75,-8.71; 13 -8.75,-9.98; 14 -8.75,-11.25; 27 8.75,-11.25; 28 8.75,-9.98; 29 8.75,-8.71; 30 8.75,-7.44; 31 8.75,-6.17; 32 8.75,-4.9; 33 8.75,-3.63; 34 8.75,-2.36; 35 8.75,-1.09; 36 8.75,0.18; 37 8.75,1.45; 38 8.75,2.72; 39 8.75,3.99; 40 8.75,5.26 | smd 0.9 x 1.5: 15 -6.985,-12.5; 16 -5.715,-12.5; 17 -4.445,-12.5; 18 -3.175,-12.5; 19 -1.905,-12.5; 20 -0.635,-12.5; 21 0.635,-12.5; 22 1.905,-12.5; 23 3.175,-12.5; 24 4.445,-12.5; 25 5.715,-12.5; 26 6.985,-12.5 | smd 0.9 x 0.9: 41 -1.5,-2.46; 42 -1.5,-1.06; 43 -2.9,-1.06; 44 -2.9,-2.46; 45 -2.9,-3.86; 46 -1.5,-3.86; 47 -0.1,-3.86; 48 -0.1,-2.46; 49 -0.1,-1.06
SSW-101-02-G-S = drill 1 pad 1.5 octagon: 1 0,0
SSW-110-02-G-S = drill 1 pad 1.5 octagon: 1 -11.43,0; 2 -8.89,0; 3 -6.35,0; 4 -3.81,0; 5 -1.27,0; 6 1.27,0; 7 3.81,0; 8 6.35,0; 9 8.89,0; 10 11.43,0
SSW-102-02-G-S = drill 1 pad 1.5 octagon: 1 -1.27,0; 2 1.27,0

### Placement (x,y rotation side)
BT1  38.35,61.09 180 top
C1  56.13,20.32 90 top
C2  52.45,6.48 0 bottom
C3  20.07,9.4 90 bottom
C4  23.11,9.4 90 bottom
C5  40.89,29.34 180 top
C6  40.89,23.24 0 top
C7  50.29,25.4 180 top
C8  55.5,24.77 0 top
C9  55.5,26.8 0 top
C10  26.16,9.4 90 bottom
C11  29.21,9.4 90 bottom
C12  36.32,9.4 90 bottom
C13  40.89,9.91 0 bottom
C14  19.3,1.4 180 bottom
C15  24.26,1.4 180 bottom
C16  10.67,29.34 0 top
C17  55.5,22.73 180 bottom
C18  55.5,24.77 180 bottom
C19  55.5,26.8 180 bottom
C20  52.45,4.45 0 bottom
C21  27.94,3.17 270 top
C22  42.67,42.29 270 top
C23  40.64,42.29 270 top
C24  40.51,56.26 0 top
C25  40.51,54.23 0 top
C26  40.51,52.2 0 top
D1  38.1,3.56 270 bottom
IC1  8.51,6.73 270 bottom
IC2  32.77,10.16 270 bottom
IC3  48.26,38.1 0 top
J1  38.1,3.56 0 top
J2  11.43,49.91 90 top
J3  2.16,42.55 270 top
J4  2.16,56.52 270 top
J6  7.24,42.55 270 top
J7  7.24,56.52 270 top
L1  51.05,28.45 0 top
L2  12.95,54.1 90 top
LED1  13.21,61.47 180 top
Q1  56.13,7.37 0 bottom
Q2  31.75,44.45 90 top
R1  56.13,17.27 90 top
R2  24.77,5.33 180 top
R3  28.32,10.29 270 top
R4  21.46,4.83 90 bottom
R5  24,3.94 0 bottom
R6  52.83,24.89 270 top
R7  40.89,27.3 0 top
R8  40.89,25.27 0 top
R9  42.67,15.24 90 top
R10  40.64,15.24 90 top
R11  35.18,3.68 90 bottom
R12  41.02,3.68 270 bottom
R13  13.72,29.34 0 top
R14  16.76,29.34 180 top
R15  44.7,42.29 90 top
R16  43.56,56.26 0 top
R17  15.62,61.59 90 top
R18  15.49,53.09 270 top
R19  30.48,40.64 180 top
R20  33.53,40.64 180 top
RN1  33.02,10.16 180 top
RN2  55.75,13.97 270 top
S1  50.67,2.54 0 top
S2  49.53,15.24 90 top
S3  24.51,2.79 180 top
SJ2  48.26,43.18 0 top
U1  34.67,55.24 180 top
U2  45.85,26.67 0 top
U3  45.85,21.21 180 bottom
U4  20.32,21.34 0 bottom
U5  24.13,55.88 0 top
U$1  42.67,49.4 0 top
U$2  37.97,13.46 180 top
X9  1.27,15.24 90 top
X10  12.19,15.49 0 top
X11  1.27,29.21 0 bottom
X12  1.27,1.27 0 bottom
X13  59.69,29.21 180 bottom
X14  59.69,1.27 180 bottom
X17  1.27,35.56 0 top
X18  1.27,63.5 0 top
X19  59.69,63.5 0 top
X20  59.69,35.56 0 top
X21  3.81,35.56 180 top
X22  57.15,35.56 0 top
X23  57.15,63.5 0 top
X24  3.81,63.5 180 top
X25  59.69,49.53 90 top
X27  59.69,15.24 90 bottom
X33  57.15,2.54 270 bottom

### Tracks (layer width: path | path; a pad name or v marks a point on that pad's centre or on a via)
3V3_B  (via drill 0.35)
  Top 0.254: IC3.21 v48.51,41.14 v48.51,41.15 | C23.1 C22.1 R15.2 44.45,43.4 44.45,45.72
  Top 0.508: U$1.1 39.66,50.24 C26.1 | C26.1 C25.1 C24.1 | C26.1 34.72,52.2 U1.8 29.54,54.28 27.94,55.88 27.94,60.96 28.76,61.78 U5.23
  Top 0.813: X25.2 54.61,45.72 v48.51,45.72 44.45,45.72 44.18,45.72 U$1.1
  Bottom 0.254: v48.51,41.15 v48.51,45.72
9
  Top 0.254: IC3.15 51.69,37.85 52.07,37.47 52.07,35.31 51.44,34.67 38.65,34.67 R20.2 R19.1
10_BRX  (via drill 0.35)
  Top 0.254: IC3.13 50.26,36.1 v50.29,36.07
  Bottom 0.254: v50.29,36.07 50.29,37.08 54.44,41.23 54.44,45.55 X25.6
10_TRX  (via drill 0.35)
  Top 0.254: v31.75,27.81 31.75,22.86 v31.62,22.73
  Bottom 0.254: v31.75,27.81 31.91,27.81 33.79,29.69 56.02,29.69 58.12,27.6 58.12,18.09 X27.6 | v31.62,22.73 31.65,22.71 31.65,22.38 35.87,18.16 U4.RXEN
11_BTX  (via drill 0.35)
  Top 0.254: IC3.14 51.17,37.35 v51.31,37.21
  Bottom 0.254: v51.31,37.21 55.17,41.07 55.17,43.74 X25.5
11_TTX  (via drill 0.35)
  Top 0.254: v32.77,22.73 v32.77,27.81
  Bottom 0.254: U4.TXEN 35.18,19.43 32.77,21.84 v32.77,22.73 | v32.77,27.81 32.77,27.94 34.16,29.34 55.88,29.34 57.68,27.53 57.68,15.98 X27.5
42  (via drill 0.35)
  Top 0.254: X10.35 19.89,14.4 18.64,15.65 18.64,18.03 18.29,18.39 17.62,18.39 v17.02,17.78 | v13.46,16.92 13.21,16.95 12.83,17.42 12.83,27.94 12.87,27.94 | 12.87,27.94 R13.1 C16.2 | 12.87,27.94 15.24,27.94 15.91,28.61 R14.2
  Bottom 0.254: v13.46,16.92 15.91,16.94 16.17,16.94 v17.02,17.78
AD0  (via drill 0.3)
  Top 0.254: IC3.18 50.28,39.37 v51.44,39.37 | v51.44,43.18 SJ2.3
  Bottom 0.254: v51.44,39.37 v51.44,43.18
AD1
  Top 0.254: IC3.24 47.01,42.91 SJ2.1
BAT  (via drill 0.35)
  Top 0.305: U2.14 47.75,25.65
  Top 0.508: 47.75,25.65 U2.13 v47.75,22.36 v47.75,22.35
  Bottom 0.508: v47.75,22.35 47.75,18.29 50.29,15.75 52.07,15.75 55.58,12.24 55.58,11.23 54.51,10.16 52.07,10.16 50.67,8.76 S1.2
BOOT  (via drill 0.35)
  Top 0.254: v23.62,6.48 21.39,4.24 X10.27 | v45.21,6.35 52.83,6.35 56.13,9.65 v56.13,9.78 | S2.F1 47.8,21.54 49.03,22.77 53.72,22.77 55.12,21.38 55.12,20.49 C1.1 R1.2 55.71,18.12 v54.99,17.4
  Bottom 0.254: v23.62,6.48 31.62,6.48 34.54,3.56 41.77,3.56 44.56,6.35 v45.21,6.35 | v54.99,17.4 54.99,13.51 56.06,12.44 56.06,9.85 v56.13,9.78
BT_DOWN  (via drill 0.35)
  Top 0.254: U2.12 47.1,24.24 45.63,22.77 45.44,22.77 44.83,22.16 v44.83,21.59 | v27.43,19.91 28.07,20.55 31.11,20.55 32.13,19.53 43.33,19.53 44.77,18.1 | 44.77,18.1 47.88,14.99 v51.56,14.99 | v26.16,18.67 22.99,15.49 22.99,13.46 21.39,11.86 X10.33 | v44.83,18.16 44.77,18.1 | S2.C1 52.91,9.07 52.91,13.57 v52.95,13.6 55.09,13.6 RN2.3
  Bottom 0.254: v44.83,21.59 v44.83,18.16 | v27.43,19.91 26.19,18.67 v26.16,18.67 | v51.56,14.99 v52.95,13.6
BT_LEFT  (via drill 0.35)
  Top 0.254: S2.B1 49.98,12.13 | 49.98,12.13 49.98,12.64 51.71,14.37 RN2.2 | v28.96,19.94 31.11,19.94 31.88,19.18 42.94,19.18 49.98,12.13 | X10.32 24.41,10.59 26.16,12.35 26.16,17.14 v27.69,18.67
  Bottom 0.254: v28.96,19.94 v27.69,18.67
BT_RIGHT  (via drill 0.35)
  Top 0.254: RN2.1 55.13,15.75 51.95,18.93 | S2.E1 49.98,20.89 51.95,18.93 | 51.95,18.93 44.45,18.93 43.18,20.19 v32.38,20.19 | X10.31 24.13,9.32 26.9,12.09 26.9,16.74 28.83,18.67 v29.84,18.67
  Bottom 0.254: v32.38,20.19 31.37,20.19 v29.84,18.67
BT_UP
  Top 0.254: RN2.4 53.86,11.5 53.86,7.88 53.47,7.49 47.12,7.49 46.28,8.33 S2.A1 46.28,15.24 42.75,18.77 31.78,18.77 31.24,19.3 25.65,19.3 22.61,16.26 22.61,14.35 21.39,13.13 X10.34
D+  (via drill 0.35)
  Top 0.254: X10.14 3.44,2.54 3.44,2.02 3.44,1.64 3.94,1.14 29.72,1.14 30.23,1.65 30.86,1.65 v31.75,0.76
  Bottom 0.254: v31.75,0.76 31.88,0.63 37.97,0.63 39.24,1.91 39.24,2.11 D1.4
D-  (via drill 0.35)
  Top 0.254: X10.13 3.1,5.51 2.41,4.83 2.41,2.16 3.81,0.76 v30.73,0.76
  Bottom 0.254: D1.6 35.83,0.99 32.54,0.99 32.13,1.4 31.37,1.4 v30.73,0.76
DN  (via drill 0.2)
  Top 0.254: J1.B7 37.35,6.09 v37.26,6 | v38.35,5.97 J1.A7
  Bottom 0.254: v38.35,5.97 38.32,6 v37.26,6 37.13,5.87 37.13,4.82 D1.1
DP  (via drill 0.2)
  Top 0.254: J1.B6 38.89,6.95 38.89,6.27 | 38.89,6.27 38.89,5.62 38.7,5.44 38.01,5.44 37.82,5.62 37.82,6.95 J1.A6 | 38.89,6.27 v39.19,5.97
  Bottom 0.254: v39.19,5.97 39.19,4.95 D1.3
EN  (via drill 0.2)
  Top 0.254: 8.64,19.43 | 8.64,19.43 8,18.79 4.02,18.79 X10.3 | 8.64,19.43 v8.64,19.85 | v10.54,19.81 11.53,18.82 11.53,17.66 11.17,17.3 10.82,17.3 8.31,14.79 8.31,9.37 4.42,5.48 4.42,2.16 5.08,1.5 19.54,1.5 20.45,2.41 22.48,2.41 22.86,2.79 | C21.1 26.63,5.33 R2.1 23.07,2.79 22.86,2.79 | 22.86,2.79 S3.2
  Bottom 0.254: v8.64,19.85 10.5,19.85 v10.54,19.81
F1  (via drill 0.35)
  Top 0.254: X10.39 24,19.48 v25.53,21.01 | v29.84,22.73 v29.84,27.81
  Bottom 0.254: v25.53,21.01 27.25,22.73 v29.84,22.73 | v29.84,27.81 30,27.81 32.59,30.4 56.32,30.4 59.66,27.06 59.66,26.7 X27.10
F1_B  (via drill 0.35)
  Top 0.406: U5.21 31.61,59.58 v31.62,59.56
  Bottom 0.406: v31.62,59.56 32.26,58.93 57.66,58.93 X25.10
F2  (via drill 0.35)
  Top 0.254: v30.86,27.81 30.86,22.83 v30.77,22.73 | v27.67,21.01 27.63,21.06 26.9,21.06 24.06,18.21 X10.38
  Bottom 0.254: v30.86,27.81 33.1,30.05 56.17,30.05 58.55,27.67 58.55,25.27 X27.9 | v30.77,22.73 29.04,21.01 v27.67,21.01
F2_B  (via drill 0.35)
  Top 0.406: U5.20 31.44,58.48 v31.62,58.29
  Bottom 0.406: v31.62,58.29 59.56,58.29 X25.9
GND  (via drill 0.2, 0.3, 0.35)  (1 unrouted)
  Top 0.254: 45.1,27.42 U2.2 | C19.2 v56.35,25.78 C18.2
  Top 0.305: U2.17 47.75,27.69 U2.18 | U2.25 46.6,27.42 | U2.10 45.85,24.77 U2.9 | U2.25 46.1,26.42 | U2.25 45.1,27.42
  Top 0.508: 11.39,14.43 v11.43,14.48 | v12.06,12.32 12.09,12.35 X10.47 | v11.43,11.56 11.51,11.63 11.43,11.63 X10.46 | X10.46 10.11,11.63 v10.03,11.56 9.96,11.63 X10.45 9.29,12.3 | 9.29,12.3 v9.27,12.32 | X10.43 9.29,13.74 | 9.29,13.74 v9.27,13.72 | X10.44 9.29,13.74 | X10.44 9.29,12.3 | X10.44 X10.41 | X10.42 X10.41 | X10.41 X10.48 | X10.41 X10.46 | 47.75,27.69 46.86,27.69 U2.25 45.85,24.77
  Top 1.016: 10.16,14.43 X10.43 X10.44 X10.45 11.43,11.63 | 10.16,14.43 X10.42 11.39,14.43 X10.49 12.09,13.69 | v12.06,13.72 12.09,13.69 | 12.09,13.69 X10.48 12.09,12.35 | v12.06,12.32 12.06,11.66 X10.47 | X10.47 11.51,11.63 | X10.47 11.43,11.63 | v10.03,11.56 10.03,14.31 10.16,14.43 | v11.43,14.48 11.43,11.63
  Bottom 0.254: C18.2 v56.35,25.78 C19.2 | C14.2 20.7,1.81 v21.21,1.81
  Bottom 0.508: IC1.3 IC1.6 | IC1.6 8,6.73 7.62,6.35 7.8,6.35 IC1.6 | v45.85,27.69 44.45,27.69 44.45,27.3 | U2.25 45.72,26.67 | v46.86,26.67 46.23,26.67 | 46.23,26.67 U2.25 | 45.72,26.67 v44.83,26.67 | v45.85,25.65 v44.83,26.67 | 45.47,27.3 v44.83,26.67 | v46.86,26.67 46.86,26.8 46.23,27.43 | v45.85,27.69 45.85,26.8 45.72,26.67 | U2.25 45.85,26.42 | 45.85,26.42 v45.85,25.65 | v45.85,25.65 45,25.65 | v44.83,26.67 44.45,27.05 44.45,27.3 | v45.85,27.69 45.47,27.3 | 45.47,27.3 44.83,27.3 | 44.83,27.3 44.45,27.3 | v44.83,26.67 44.83,27.3 | v44.83,26.67 44.45,26.67 45.47,25.65 v45.85,25.65 | v45.85,25.65 45.47,26.04 45.47,27.3 | 46.23,27.43 45.97,27.69 v45.85,27.69 | 46.23,27.43 46.23,26.67 | v46.86,26.67 46.61,26.42 45.85,26.42 | IC1.6 8.18,7.8 8.51,8.13 | v44.83,26.67 44.83,25.4 47.24,25.4 | 47.24,25.4 47.75,25.4 47.75,26.67 | 47.75,26.67 47.75,27.86 47.12,27.86 | v46.86,26.67 47.75,26.67 | v44.83,26.67 44.83,27.86 47.12,27.86 | v45.85,25.65 45.97,25.65 46.86,26.54 v46.86,26.67 | v46.86,26.67 47.12,26.42 47.12,25.53 47.24,25.4 | 47.12,27.86 47.12,26.92 v46.86,26.67
  other vias: 10.03,14.48 37.97,16 37.21,12.19 33.78,14.35 52.3,20 53.44,19.49 2.52,22.8 4.8,20.76 2.52,25.34 38.86,25.27 45.85,26.67 14.57,29.34 53.98,23.75 4.95,6.99 5.59,7.62 6.22,8.26 6.86,8.89 9.02,10.54 9.91,10.54 10.79,10.54 10.29,9.65 9.4,9.65 9.53,8.76 22.33,20.76 23.98,20.76 20.19,22.73 21.08,22.73 24,22.73 24.89,22.73 25.91,22.73 48.26,39.12 48.26,37.08 47.24,38.1 49.28,38.1 48.26,38.1 40.26,12.19 40.26,11.18 4.04,26.86 5.31,26.86 5.31,28.13 4.04,28.13 6.58,28.13 6.58,26.86 7.85,26.86 7.85,28.13 9.12,28.13 9.12,26.86 10.39,26.86 10.39,28.13 41.88,21.65 41.38,20.89 42.27,20.89 56.52,23.75 56.11,21.4 43.92,7.94 43.92,6.67 44.93,7.94 43.54,4 44.68,5.27 45.95,5.27 44.68,4 43.66,2.86 19.41,20.76 19.41,19.75 55.84,27.81 54.7,28.19 31.47,4.76 32.23,3.87 29.57,2.35 31.09,2.35 29.57,3.87 33.78,15.24 38.99,11.18 38.99,12.19 18.26,19.75 19.41,18.73 12.17,17.72 12.17,18.73 12.17,19.75 12.17,20.76 12.17,21.78 11.15,20.76 6.58,25.59 6.58,24.32 6.58,23.05 6.58,21.78 7.85,21.78 7.85,23.05 7.85,24.32 7.85,25.59 5.59,40.64 6.48,40.64 7.37,40.64 8.26,40.64 9.14,40.64 9.14,41.53 9.14,42.55 9.14,43.56 9.14,44.45 8.26,44.45 7.37,44.45 6.48,44.45 5.59,44.45 5.59,54.61 6.48,54.61 7.37,54.61 8.26,54.61 9.14,54.61 9.14,55.5 9.14,56.52 9.14,57.53 9.14,58.42 8.26,58.42 7.37,58.42 6.48,58.42 5.59,58.42 3.43,52.45 2.54,52.45 1.65,52.45 0.76,52.45 3.43,60.58 2.54,60.58 1.65,60.58 0.76,60.58 3.43,38.48 2.54,38.48 1.65,38.48 0.76,38.48 3.43,46.61 2.54,46.61 1.65,46.61 0.76,46.61 7.49,9.53 8.89,8.13 8.26,7.49 7.62,6.86 6.99,6.22 6.35,5.59 5.71,4.95 5.08,4.32 57.38,6.41 54.23,5.71 54.99,5.71 54.48,8.89 54.99,9.4 55.37,10.03 55.75,8.26 56.26,8.89 18.77,26.4 20.04,26.4 21.31,26.4 22.58,26.4 23.85,26.4 25.12,26.4 26.39,26.4 27.66,26.4 28.93,26.4 19.41,13.27 18.77,12.64 18.77,11.37 18.77,10.1 25.5,13.27 24.99,12.51 24.11,12.51 23.22,12.51 18.77,7.56 18.77,6.54 27.53,13.27 27.53,12.26 18.77,25.13 20.04,25.13 21.31,25.13 23.85,25.13 25.12,25.13 26.39,25.13 27.66,25.13 28.93,25.13 33.76,25.13 33.76,26.4 17.88,24.88 17.25,24.24 16.61,23.61 15.98,22.97 15.34,22.34 14.71,21.7 33.76,27.67 34.77,27.67 34.77,26.4 34.77,25.13 37.82,27.67 38.96,27.67 28.93,27.67 27.66,27.67 26.39,27.67 25.12,27.67 23.85,27.67 22.58,27.67 21.31,27.67 20.04,27.67 18.77,27.67 17.5,27.67 16.87,27.04 16.23,26.4 15.6,25.77 14.96,25.13 14.33,24.5 13.69,23.86 9.12,25.59 9.12,24.32 10.39,25.59
  pour Top: 0,30.48 0,0 60.96,0 60.96,30.48
  pour Bottom: 0,30.48 0,0 60.96,0 60.96,30.48
  pour Top (rank 2): 0,34.29 60.96,34.29 60.96,64.77 0,64.77
  pour Bottom (rank 2): 0,34.29 60.96,34.29 60.96,64.77 0,64.77
GSCL
  Top 0.406: U5.19 30.12,57.37 29.48,57.37 28.93,56.81 28.93,55.75 29.1,55.58 U1.6
GSDA
  Top 0.406: U1.5 30.2,56.21 U5.18
I2C_SCL  (via drill 0.35)
  Top 0.305: U2.5 43.42,25.92 v43.18,25.68 | v18.03,17.78 18.03,3.12 X10.25 | v30.48,18.03 30.99,17.53 v42.29,17.53 42.67,17.14 R9.2
  Bottom 0.254: 43.43,24.89 50.93,24.89 50.93,24.86 57.25,18.54 57.25,13.97 57.25,13.87 X27.4
  Bottom 0.305: v43.18,25.68 43.43,25.42 43.43,24.89 43.43,18.67 v42.29,17.53 | v30.48,18.03 18.29,18.03 v18.03,17.78
I2C_SCL_B  (via drill 0.3)
  Top 0.254: IC3.19 50.81,41.4 v55.75,41.4
  Bottom 0.254: X25.4 59.31,45.72 55.75,42.16 v55.75,41.4
I2C_SDA  (via drill 0.35)
  Top 0.254: X10.24 16.64,10.8 16.76,10.93 16.76,16.67 v17.02,16.92
  Top 0.305: U2.6 43.95,24.38 v44.2,24.13 | v29.21,17.14 29.46,16.89 v41.66,16.89 41.44,16.89 R10.2
  Bottom 0.254: 44.2,22.96 51.85,22.96 56.9,17.91 56.9,13.08 58.55,11.43 58.55,10.16 58.55,10.03 X27.3 | 44.2,22.86 v44.2,24.13 | v17.02,16.92 17.24,17.14 v29.21,17.14
  Bottom 0.305: v41.66,16.89 42.67,16.89 44.2,18.41 44.2,22.86 | v44.2,24.13 44.2,22.96
I2C_SDA_B  (via drill 0.3)
  Top 0.254: IC3.20 49.01,40.76 49.85,41.59 49.91,41.66 50.41,42.15 50.46,42.15 50.48,42.16 v56.64,42.16
  Bottom 0.254: v56.64,42.16 58.67,42.16 X25.3
IR_RX  (via drill 0.25)
  Top 0.254: X10.4 4.03,17.54 4.29,17.54 5.19,18.44 8.27,18.44 9.17,19.34 9.17,19.96 9.65,20.45 9.65,21.46 v9.53,21.59 | v29.21,30.23 29.46,30.48 55.3,30.48 57.51,28.27 57.51,23.77 X27.8
  Bottom 0.254: v9.53,21.59 9.73,21.8 9.73,21.82 18.14,30.23 v29.21,30.23
IR_TX  (via drill 0.25)
  Top 0.254: X10.5 3.74,15.67 6.14,18.08 8.42,18.08 9.52,19.19 9.52,19.81 10.29,20.57 v10.29,21.59 | v30.1,29.9 30.18,29.9 30.35,30.07 55.21,30.07 57.15,28.13 57.15,22.73 59.69,20.19 X27.7
  Bottom 0.254: v10.29,21.59 18.34,29.64 29.84,29.64 v30.1,29.9
MCU_3V3  (via drill 0.35)
  Top 0.254: R3.2 24.22,5.33 R2.2
  Top 0.305: R10.1 41.91,14.39 R9.1
  Top 0.508: R1.1 56.38,16.18 RN2.8 RN2.7 RN2.6 RN2.5 56.38,12.31 55.5,11.43 v54.74,11.43 | R3.2 28.42,9.54 RN1.5 | RN1.5 RN1.6 RN1.7 RN1.8 | U$2.4 31.65,14.07 v31.62,14.1 | X10.2 3.52,19.4 v7.75,19.4 | v41.91,8.15 41.91,14.39 | R9.1 R10.1 | RN1.5 v31.82,8.44 v31.83,8.43
  Bottom 0.508: C11.+ 31.04,8 IC2.5 v31.83,8.43 32.38,7.87 34.34,7.87 | v54.74,11.43 51.05,11.43 49.78,10.16 44.78,10.16 42.77,8.15 v41.91,8.15 38.61,8.15 37.1,6.64 35.58,6.64 34.34,7.87 | 34.34,7.87 34.8,8.33 34.8,12.19 32.89,14.1 v31.62,14.1 12.95,14.1 11.18,15.88 7.78,15.88 7.75,15.85 | 7.75,15.85 1.25,9.35 1.25,8.91 X9.2 2.54,7.62 2.54,2.54 3.68,1.4 C14.1 18.41,1.4 19.68,2.67 22.35,2.67 22.86,2.16 C15.1 | 7.75,15.85 v7.75,19.4
MCU_MISO  (via drill 0.35)
  Top 0.254: U$2.7 34.95,14.71 v34.8,14.86 | X10.12 3.49,6.74 3.65,6.74 7.95,11.04 7.95,14.94 v10.92,17.91
  Top 0.508: U$2.7 34.95,12.98 33.42,11.45 RN1.2
  Bottom 0.254: v10.92,17.91 12.63,16.2 33.68,16.2 34.8,15.08 v34.8,14.86
MCU_MOSI  (via drill 0.35)
  Top 0.254: X9.4 1.27,12.95 2.38,11.84 2.38,10.07 3.12,9.32 X10.10 3.74,9.32 7.24,12.83 7.24,15.49 9.14,17.4 v9.14,17.91 | U$2.3 30.48,13.3 v30.48,14.86
  Top 0.508: U$2.3 30.55,13.14 32.62,11.07 RN1.3
  Bottom 0.254: v9.14,17.91 10.41,16.64 11.18,16.64 12.35,15.47 29.97,15.47 30.48,14.96 v30.48,14.86
MCU_SCK  (via drill 0.35)
  Top 0.254: X9.3 1.27,10.41 2.38,9.3 2.38,8.86 3.19,8.05 X10.11 3.62,7.87 3.94,7.87 3.94,8.3 7.59,11.95 7.59,15.21 10.03,17.65 v10.03,17.91 | v32.51,14.86 32.75,14.62 U$2.5
  Bottom 0.254: v32.51,14.86 32.51,14.96 31.62,15.85 12.47,15.85 11.3,17.02 10.92,17.02 v10.03,17.91
N$1  (via drill 0.35)
  Top 0.254: J1.A5 36.85,6.38 35.43,4.95 v35.18,4.95
  Bottom 0.254: v35.18,4.95 R11.2
N$2  (via drill 0.35)
  Top 0.254: J1.B5 39.85,6.12 v41.02,4.95
  Bottom 0.254: v41.02,4.95 R12.1
N$3  (via drill 0.3)
  Top 0.406: R16.1 42.71,56.39 42.22,56.88 42.22,56.89 39.41,59.69 v38.1,59.69 | U5.22 32.96,60.68 BT1.+ 34.19,60.34 v34.83,59.7
  Bottom 0.406: v38.1,59.69 v34.84,59.69 v34.83,59.7
N$5
  Top 0.813: U5.3 15.69,60.68 R17.1
N$6
  Top 0.813: R17.2 13.28,62.45 LED1.A
N$7
  Top 0.406: U$1.2 44.85,55.83 R16.2
N$8
  Top 0.508: U$2.1 28.35,11.16 R3.1
N$9
  Top 0.813: U5.11 12.7,49.98 | 12.7,49.98 12.47,49.98 J2.1 | L2.1 12.7,52.45 12.7,49.98
N$10  (via drill 0.35)
  Top 0.254: IC3.23 47.51,41.04 v47.62,41.15
  Bottom 0.254: v47.62,41.15 45,41.15 R15.1
  other vias: 44.7,41.44
N$11
  Top 0.813: R18.1 13.93,55.5 L2.2
N$12
  Top 0.406: R19.2 30.8,41.81 Q2.1
N$13  (via drill 0.35)
  Top 0.508: v56.18,5.84 56.18,6.31 v55.12,7.37
  Bottom 0.508: X33.1 56.18,4.78 v56.18,5.84 | Q1.3 v55.12,7.37
N$15
  Top 0.254: J6.1 6.15,42.55
  Top 1.27: 6.15,42.55 J3.1
N$16
  Top 0.508: RN1.1 36.05,12.61 U$2.8
N$18
  Bottom 0.508: IC1.5 20.82,3.33 R4.1 R5.2
N$19
  Top 0.254: J7.1 6.15,56.52
  Top 1.27: 6.15,56.52 J4.1
N$20
  Top 0.305: C7.1 51.14,29 50.55,29.59 46.48,29.59 46.1,29.21 U2.21
N$22
  Top 0.305: U2.20 U2.19 49.33,28.57
  Top 0.406: L1.1 | C7.2 L1.1 | L1.1 49.33,28.57
N$23  (via drill 0.35)
  Top 0.305: U2.8 v45.1,23.89 v45.09,23.88 | v51.05,23.88 52.67,23.88 R6.2
  Bottom 0.305: v51.05,23.88 v45.09,23.88
N$24
  Top 0.305: R7.1 41.74,25.61 R8.2 41.87,25.27 43.9,23.24 45.47,23.24 46.6,24.37 U2.11
N$29  (via drill 0.35)
  Top 0.305: U2.23 45.1,29 44.92,29.18 43.66,29.18 42.55,28.07 42.55,26.54 v42.67,26.42 | v42.8,23.37 42.67,23.24 C6.2
  Bottom 0.305: v42.67,26.42 42.55,26.29 42.55,25.27 42.8,25.02 v42.8,23.37
REGN
  Top 0.305: U2.22 45.6,29.08 45.09,29.59 42,29.59 C5.1 R7.2
RF_3V3  (via drill 0.35)
  Top 0.508: v30.99,5.68 31.08,5.68 34.13,8.73 37.3,8.73 v37.47,8.89 | v47.86,16.11 v49.53,17.78
  Bottom 0.508: IC1.4 17.77,5.03 18.41,5.68 R4.2 | R4.2 23.11,7.33 C4.+ | C12.+ 36.58,8 v37.47,8.89 | v37.47,8.89 41.28,8.89 C13.+ 43.44,11.05 49.53,11.05 50.29,11.81 U3.1 50.29,13.69 v47.86,16.11 | U4.VCC 37.08,15.62 38.1,14.61 38.1,9.52 v37.47,8.89 | R4.2 v30.99,5.68 | v49.53,17.78 49.53,17.86 50.29,18.62 54.93,18.62 55.8,17.75 55.8,13.38 58.01,11.17 58.01,9.09 58.34,8.76 58.34,7.7 X27.2
RF_CE2  (via drill 0.35)
  Top 0.254: X10.23 15.37,10.03 16.41,11.07 16.41,19.14 18.89,21.62 40.48,21.62 v40.64,21.46
  Bottom 0.254: v40.64,21.46 40.64,21.43 40.57,21.35 40.57,15.94 41.19,15.32 46.84,15.32 49.02,13.13 U3.2
RF_CSN  (via drill 0.35)
  Top 0.254: X10.16 6.48,4.16 14.22,11.91 14.22,17.02 v13.46,17.78
  Bottom 0.254: U4.CSN 35.69,20.7 33.05,23.34 19.02,23.34 v13.46,17.78
RF_CSN2  (via drill 0.35)
  Top 0.254: X10.22 14.1,9.27 16.05,11.22 16.05,19.41 18.74,22.1 39.88,22.1 v40.01,22.23
  Bottom 0.254: v40.01,22.23 40.01,16 41.05,14.96 45.92,14.96 47.75,13.13 U3.3
RF_GDO0  (via drill 0.35)
  Top 0.254: X10.17 7.75,4.93 14.61,11.79 14.61,17.53 v13.46,18.67
  Bottom 0.254: v13.46,18.67 18.54,23.75 33.91,23.75 35.69,21.97 U4.GDO0
RF_MISO  (via drill 0.35)
  Top 0.254: X10.19 10.29,6.96 14.99,11.66 14.99,18.03 v13.46,19.56
  Bottom 0.254: U3.6 43.94,13.21 43.18,13.97 41.02,13.97 38.35,16.64 38.35,23.86 37.71,24.51 U4.MISO 18.41,24.51 v13.46,19.56
RF_MOSI  (via drill 0.35)
  Top 0.254: v44.45,13.97 44.45,16.51 42.8,18.16 v39.37,18.16 | X10.20 11.56,7.73 15.34,11.52 15.34,18.79 13.69,20.45 v13.46,20.45
  Bottom 0.254: v39.37,18.16 39.37,23.39 40.36,24.39 40.36,26.03 39.34,27.05 U4.MOSI 18.29,27.05 12.83,21.59 12.83,21.08 v13.46,20.45 | U3.5 45.21,13.21 v44.45,13.97
RF_SCK  (via drill 0.35)
  Top 0.254: X10.21 12.83,8.5 15.7,11.37 15.7,19.1 v13.46,21.34
  Bottom 0.254: U3.4 46.48,13.21 45.09,14.61 40.89,14.61 38.73,16.76 38.73,23.37 40.01,24.64 40.01,25.78 39.5,26.29 37.47,26.29 36.96,25.78 U4.SCK 17.91,25.78 v13.46,21.34
SD_CS  (via drill 0.35)
  Top 0.254: v29.46,14.86 29.46,13.25 U$2.2 | X10.15 5.21,3.39 13.46,11.65 v13.46,14.83
  Top 0.508: U$2.2 29.45,13.1 31.76,10.79 RN1.4
  Bottom 0.254: v13.46,14.83 13.36,14.86 v29.46,14.86
TFT_BL  (via drill 0.35)
  Top 0.254: X9.8 3.05,24.13 v6.86,20.32 | X10.6 4.24,14.4 5.59,15.75 5.59,16.89 5.97,17.27 v6.99,17.27
  Bottom 0.254: v6.86,20.32 6.99,20.19 v6.99,17.27
TFT_CS  (via drill 0.35)
  Top 0.254: X10.7 3.69,13.13 6.22,15.66 v6.22,16.64
  Bottom 0.254: v6.22,16.64 6.22,20.45 5.08,21.59 X9.7
TFT_DC
  Top 0.254: X10.8 3.19,11.86 2.34,12.72 2.34,17.98 X9.6
TFT_RST  (via drill 0.35)
  Top 0.254: v6.86,16 6.86,13.59 3.86,10.59 X10.9
  Bottom 0.254: v6.86,16 1.78,16 X9.5
TG-
  Top 0.406: U1.7 U1.2 | C24.2 40.47,57.15 37.64,57.15 U1.4
  Top 0.508: J2.4 11.28,50.91 10.4,50.04 J2.3 10.4,49.81 11.3,48.91 J2.2
  Top 0.813: 19.05,48.88 U5.12 11.46,48.88 J2.2 11.43,49.91 | 19.05,48.88 22.86,48.88 | 19.05,51.08 U5.10 13.71,51.08 | 19.05,51.08 20.66,51.08 | 20.66,51.08 22.86,48.88 | 11.43,49.91 J2.4 | 11.43,49.91 J2.3 | 20.66,56.22 20.66,51.08 | 38.86,57.27 34.3,61.84 BT1.- 32.31,62.88 U5.24 27.32,62.88 20.66,56.22 | 38.86,57.27 37.76,57.27 U1.4 U1.3 U1.2 U1.1 | 38.86,57.27 40.42,57.27 41.36,56.34 C24.2 C25.2 C26.2 | Q2.3 31.75,47.26 U5.13 22.86,48.88 | LED1.C 13.21,59.18 16.11,56.28 U5.7 20.6,56.28 20.66,56.22 | 19.05,48.88 19.66,49.5 19.66,50.46 19.05,51.08
  pour Top: 32.77,44.96 13.46,44.96 9.91,48.51 9.91,51.69 11.43,53.21 11.43,63.37 12.83,64.77 34.54,64.77 42.04,57.28 42.04,51.18 38.99,51.18
VBAT  (via drill 0.35)
  Top 0.254: R14.1 17.87,29.08 32.76,29.08 32.77,29.09 34.29,29.09 v34.67,28.7 | v57.05,20.36 57.19,20.22 57.19,10.89 v57.28,10.79
  Bottom 0.254: v34.67,28.7 34.92,28.96 55.75,28.96 57.15,27.56 57.13,27.54 57.13,20.43 v57.05,20.36 | v57.28,10.79 57.28,8.42 Q1.1
  Bottom 0.508: Q1.1 55.54,6.47 55.53,6.48 C2.1 C20.1 53.3,3.17 S1.3 52.67,1.56 53.72,0.51 56.39,0.51 X33.2
VCC_RF
  Top 0.508: U5.8 U5.9 18.07,52.24 R18.2
VIN  (via drill 0.2, 0.25)
  Top 0.254: U2.1 43.67,27.92 v43.18,27.43 | v43.69,16.26 43.69,13.59 43.2,13.1 43.2,5.7 42.74,5.24 | 42.74,5.24 41.62,5.24 40.51,6.35 40.51,6.99 | v38.1,2.43 39.35,3.68 41.19,3.68 42.74,5.24
  Top 0.508: J1.A4B9 35.7,7.63 36.07,8 40.13,8 40.51,7.62 40.51,6.99 J1.B4A9
  Bottom 0.254: v43.69,16.26 43.66,16.28 41.28,16.28 40.92,16.64 40.92,17.14 41.91,18.13 42.14,18.13 42.93,18.92 42.93,22.38 41.94,23.37 41.94,26.67 42.67,27.4 42.67,27.43 v43.18,27.43 43.18,27.48 44.17,28.47 52.97,28.47 C19.1 C18.1 C17.1 | D1.5 v38.1,2.43
VOUT  (via drill 0.35)
  Top 0.305: 52.83,25.78 R6.1 | 47.75,26.67 U2.16 48.52,26.92 48.64,26.8 v48.64,26.67 | 47.75,26.67 U2.15 48.52,26.42 48.64,26.54 v48.64,26.67 | 47.75,26.67 v48.64,26.67
  Top 0.508: v27.56,7.24 32.13,2.67 32.13,2.03 33.53,0.64 43.69,0.64 45.54,2.49 45.54,3.81 46.71,4.98 57.15,4.98 58.55,6.38 58.55,20.61 54.65,24.51 C8.1
  Top 0.813: L1.2 52.65,27.38 v51.94,26.67 52.83,25.78 | R6.1 53.89,26.8 C9.1 C8.1 54.27,24.77 53.29,25.74 R6.1
  Bottom 0.508: IC1.1 IC1.2 16.38,8.38 19.68,8.38 C3.+ 21.01,8 22.37,9.35 24.88,9.35 26.16,8.07 C10.+ | IC2.1 31.83,11.31 31.21,10.7 | 31.21,10.7 29.87,9.35 27.52,9.35 C10.+ | 31.21,10.7 33.43,10.7 33.71,10.97 IC2.3 | C10.+ 26.8,8 v27.56,7.24
  Bottom 0.813: v48.64,26.67 v51.94,26.67